# EAGLE schematic Sherline Configuration (EAGLE 6.4)

## Sheet 1 of 16
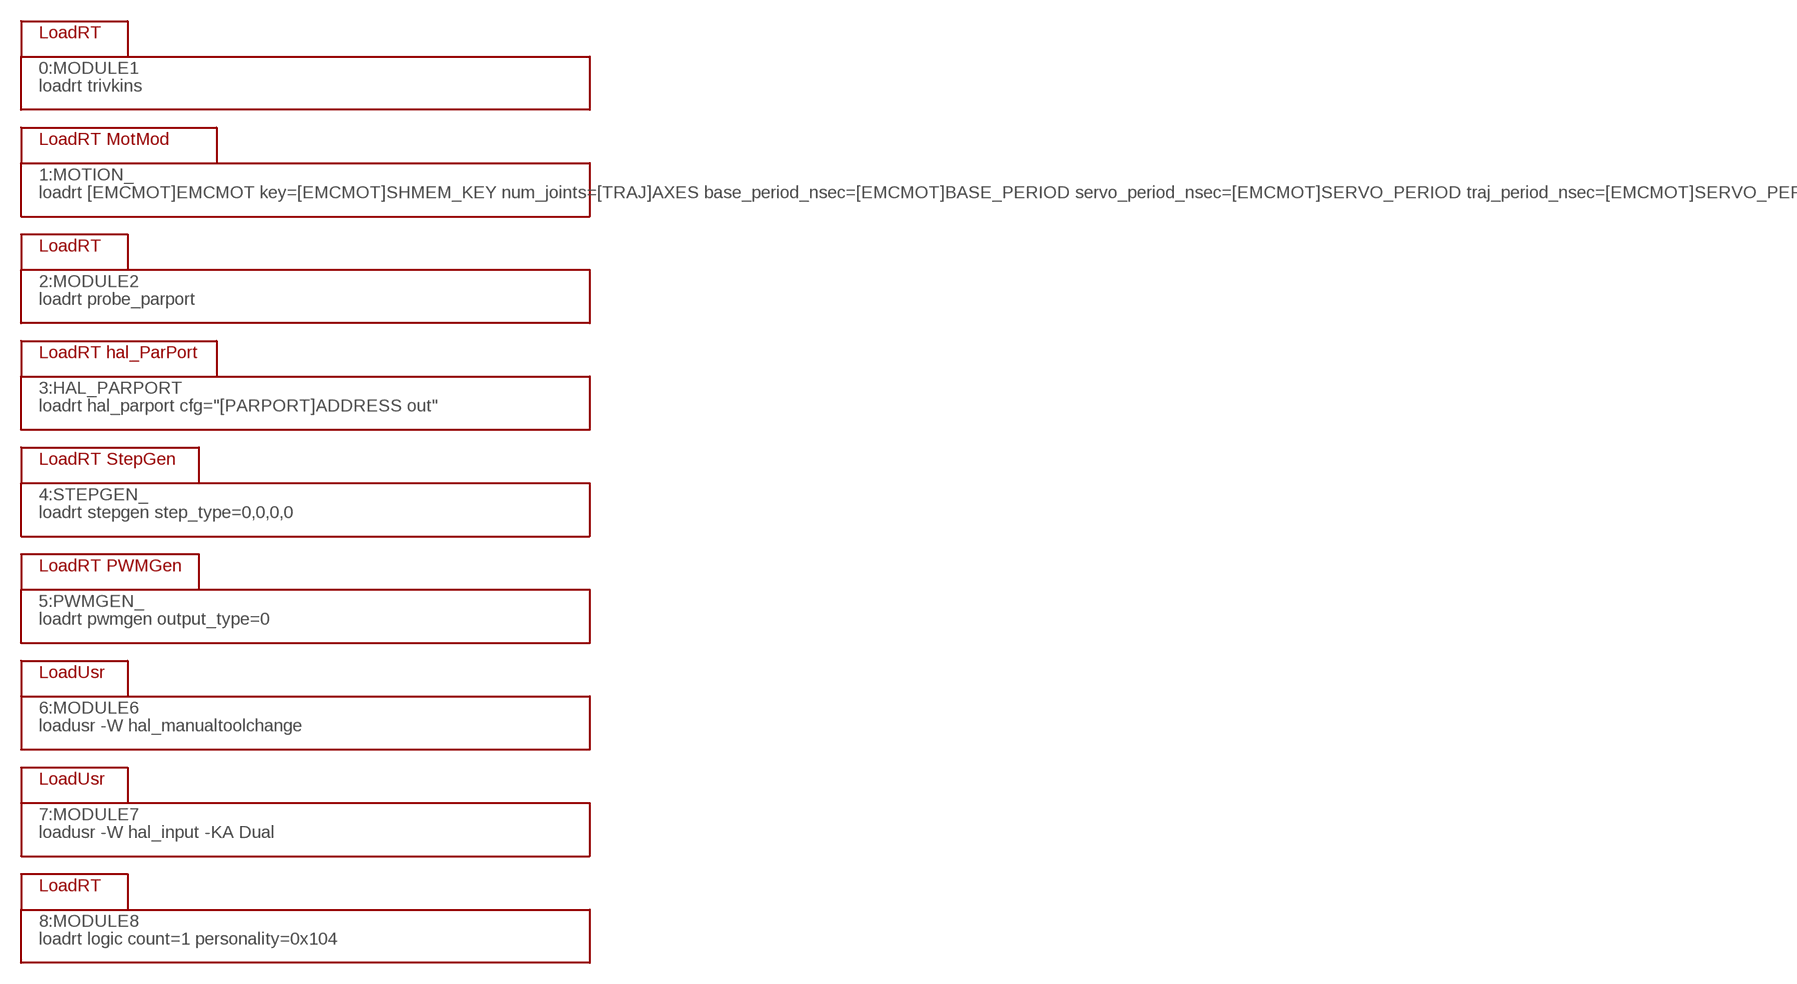
[diagram p0: schematic, sheet 1]

### Parts
0:MODULE1  loadrt trivkins  LOADRT  [DUMMY]
1:MOTION  loadrt [EMCMOT]EMCMOT key=[EMCMOT]SHMEM_KEY num_joints=[TRAJ]AXES base_period_nsec=[EMCMOT]BASE_PERIOD servo_period_nsec=[EMCMOT]SERVO_PERIOD traj_period_nsec=[EMCMOT]SERVO_PERIOD  LOADRT_MOTMOD  [DUMMY]
2:MODULE2  loadrt probe_parport  LOADRT  [DUMMY]
3:HAL_PARPORT  loadrt hal_parport cfg="[PARPORT]ADDRESS out"  LOADRT_PARPORT  [DUMMY]
4:STEPGEN  loadrt stepgen step_type=0,0,0,0  LOADRT_STEPGEN  [DUMMY]
5:PWMGEN  loadrt pwmgen output_type=0  LOADRT_PWMGEN  [DUMMY]
8:MODULE8  loadrt logic count=1 personality=0x104  LOADRT  [DUMMY]
Unconnected: 3:HAL_PARPORT.P$1(PIN_THREAD) 3:HAL_PARPORT.P$2(PIN_THREAD)

## Sheet 2 of 16
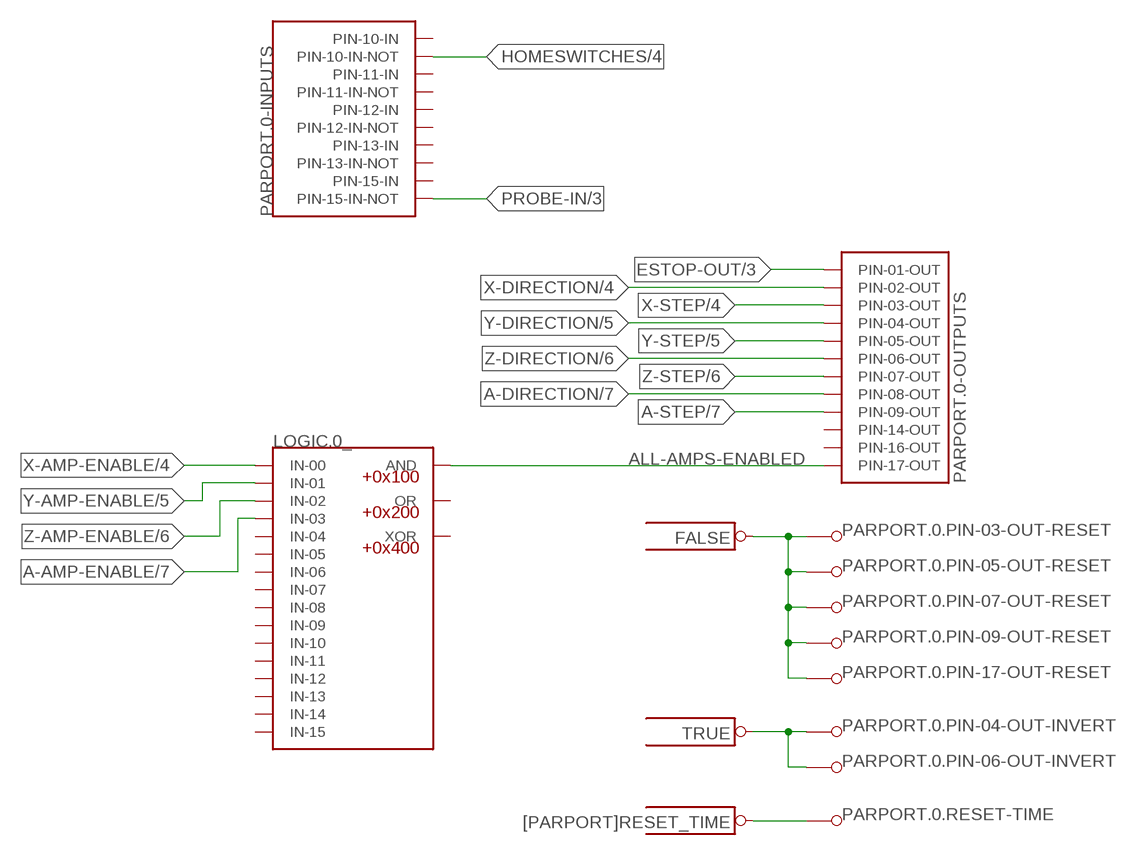
[diagram p1: schematic, sheet 2]

### Parts
LOGIC.0  LOGIC  [DUMMY]
PARAMETER0  [PARPORT]RESET_TIME  PARAMETER  [DUMMY]
PARAMETER8  FALSE  PARAMETER  [DUMMY]
PARAMETER30  TRUE  PARAMETER  [DUMMY]
PARPORT.0  PARPORT-OUT  [DUMMY]

### Nets
A-AMP-ENABLE: LOGIC.0.P$6(_:IN-03) ; also sheet 7
A-DIRECTION: PARPORT.0.P$41(-OUTPUTS:PIN-08-OUT) ; also sheet 7
A-STEP: PARPORT.0.P$42(-OUTPUTS:PIN-09-OUT) ; also sheet 7
ALL-AMPS-ENABLED: LOGIC.0.P$2(_:AND) PARPORT.0.P$45(-OUTPUTS:PIN-17-OUT)
ESTOP-OUT: PARPORT.0.P$34(-OUTPUTS:PIN-01-OUT) ; also sheet 3
HOMESWITCHES: PARPORT.0.P$25(-INPUTS:PIN-10-IN-NOT) ; also sheet 4,5,6,7
N$1: PARAMETER0.P$1 PARPORT.0.P$22(.RESET-TIME:PIN_PARAMETER)
N$12: PARAMETER8.P$1 PARPORT.0.P$5(.PIN-03-OUT-RESET:PIN_PARAMETER) PARPORT.0.P$9(.PIN-05-OUT-RESET:PIN_PARAMETER) PARPORT.0.P$13(.PIN-07-OUT-RESET:PIN_PARAMETER) PARPORT.0.P$17(.PIN-09-OUT-RESET:PIN_PARAMETER) PARPORT.0.P$50(.PIN-17-OUT-RESET:PIN_PARAMETER)
N$81: PARAMETER30.P$1 PARPORT.0.P$6(.PIN-04-OUT-INVERT:PIN_PARAMETER) PARPORT.0.P$10(.PIN-06-OUT-INVERT:PIN_PARAMETER)
PROBE-IN: PARPORT.0.P$33(-INPUTS:PIN-15-IN-NOT) ; also sheet 3
X-AMP-ENABLE: LOGIC.0.P$3(_:IN-00) ; also sheet 4
X-DIRECTION: PARPORT.0.P$35(-OUTPUTS:PIN-02-OUT) ; also sheet 4
X-STEP: PARPORT.0.P$36(-OUTPUTS:PIN-03-OUT) ; also sheet 4
Y-AMP-ENABLE: LOGIC.0.P$4(_:IN-01) ; also sheet 5
Y-DIRECTION: PARPORT.0.P$37(-OUTPUTS:PIN-04-OUT) ; also sheet 5
Y-STEP: PARPORT.0.P$38(-OUTPUTS:PIN-05-OUT) ; also sheet 5
Z-AMP-ENABLE: LOGIC.0.P$5(_:IN-02) ; also sheet 6
Z-DIRECTION: PARPORT.0.P$39(-OUTPUTS:PIN-06-OUT) ; also sheet 6
Z-STEP: PARPORT.0.P$40(-OUTPUTS:PIN-07-OUT) ; also sheet 6
Unconnected: LOGIC.0.P$7(_:IN-04) LOGIC.0.P$8(_:IN-05) LOGIC.0.P$9(_:IN-06) LOGIC.0.P$10(_:IN-07) LOGIC.0.P$11(_:IN-08) LOGIC.0.P$12(_:IN-09) LOGIC.0.P$13(_:IN-10) LOGIC.0.P$14(_:IN-11) LOGIC.0.P$15(_:IN-12) LOGIC.0.P$16(_:IN-13) LOGIC.0.P$17(_:IN-14) LOGIC.0.P$18(_:IN-15) LOGIC.0.P$19(_:OR) LOGIC.0.P$20(_:XOR) PARPORT.0.P$1(.PIN-01-OUT-INVERT:PIN_PARAMETER) PARPORT.0.P$2(.PIN-02-OUT-INVERT:PIN_PARAMETER) PARPORT.0.P$3(.PIN-02-OUT-RESET:PIN_PARAMETER) PARPORT.0.P$4(.PIN-03-OUT-INVERT:PIN_PARAMETER) PARPORT.0.P$7(.PIN-04-OUT-RESET:PIN_PARAMETER) PARPORT.0.P$8(.PIN-05-OUT-INVERT:PIN_PARAMETER) PARPORT.0.P$11(.PIN-06-OUT-RESET:PIN_PARAMETER) PARPORT.0.P$12(.PIN-07-OUT-INVERT:PIN_PARAMETER) PARPORT.0.P$14(.PIN-08-OUT-INVERT:PIN_PARAMETER) PARPORT.0.P$15(.PIN-08-OUT-RESET:PIN_PARAMETER) PARPORT.0.P$16(.PIN-09-OUT-INVERT:PIN_PARAMETER) PARPORT.0.P$18(.PIN-14-OUT-INVERT:PIN_PARAMETER) PARPORT.0.P$19(.PIN-16-OUT-INVERT:PIN_PARAMETER) PARPORT.0.P$20(.PIN-17-OUT-INVERT:PIN_PARAMETER) PARPORT.0.P$24(-INPUTS:PIN-10-IN) PARPORT.0.P$26(-INPUTS:PIN-11-IN) PARPORT.0.P$27(-INPUTS:PIN-11-IN-NOT) PARPORT.0.P$28(-INPUTS:PIN-12-IN) PARPORT.0.P$29(-INPUTS:PIN-12-IN-NOT) PARPORT.0.P$30(-INPUTS:PIN-13-IN) PARPORT.0.P$31(-INPUTS:PIN-13-IN-NOT) PARPORT.0.P$32(-INPUTS:PIN-15-IN) PARPORT.0.P$43(-OUTPUTS:PIN-14-OUT) PARPORT.0.P$44(-OUTPUTS:PIN-16-OUT) PARPORT.0.P$47(.PIN-01-OUT-RESET:PIN_PARAMETER) PARPORT.0.P$48(.PIN-14-OUT-RESET:PIN_PARAMETER) PARPORT.0.P$49(.PIN-16-OUT-RESET:PIN_PARAMETER)

## Sheet 3 of 16
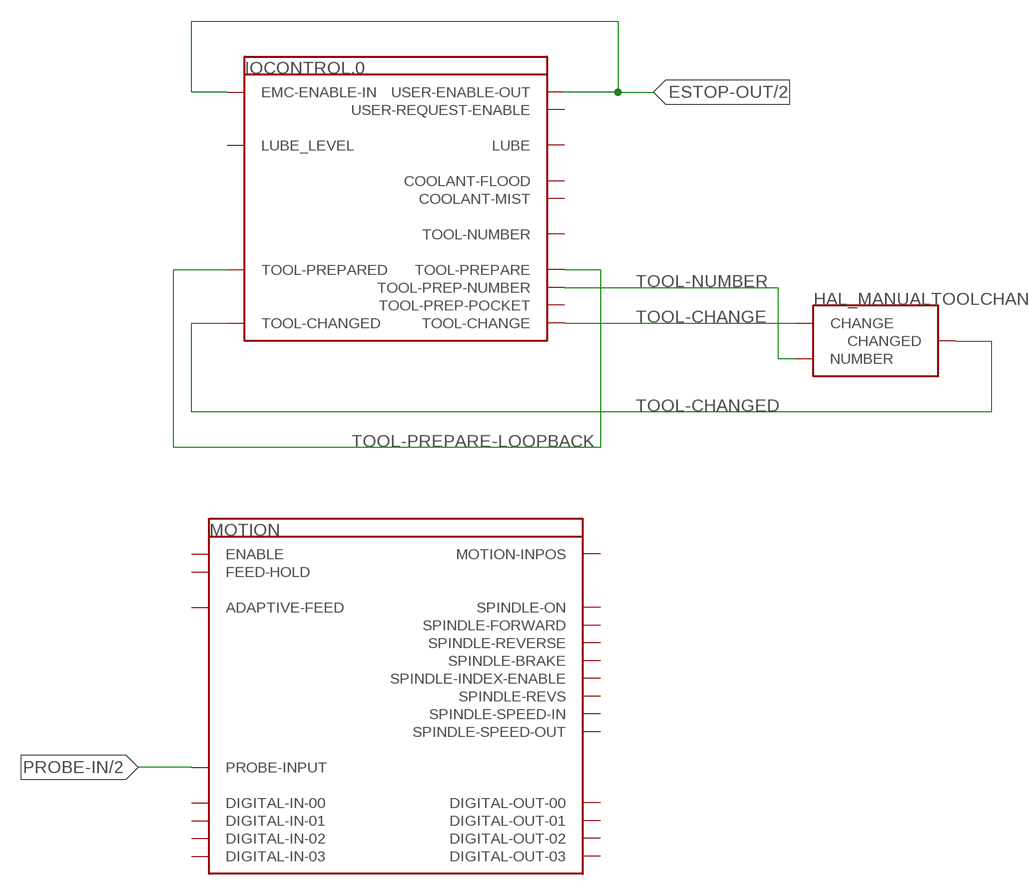
[diagram p2: schematic, sheet 3]

### Parts
HAL_MANUALTOOLCHANGE  HAL_MANUALTOOLCHANGE  [DUMMY]
IOCONTROL.0  IOCONTROL  [DUMMY]
MOTION  MOTION  [DUMMY]

### Nets
ESTOP-OUT: IOCONTROL.0.P$3(EMC-ENABLE-IN) IOCONTROL.0.P$11(USER-ENABLE-OUT) ; also sheet 2
PROBE-IN: MOTION.P$23(PROBE-INPUT) ; also sheet 2
TOOL-CHANGE: HAL_MANUALTOOLCHANGE.P$1(CHANGE) IOCONTROL.0.P$6(TOOL-CHANGE)
TOOL-CHANGED: HAL_MANUALTOOLCHANGE.P$2(CHANGED) IOCONTROL.0.P$7(TOOL-CHANGED)
TOOL-NUMBER: HAL_MANUALTOOLCHANGE.P$3(NUMBER) IOCONTROL.0.P$8(TOOL-PREP-NUMBER)
TOOL-PREPARE-LOOPBACK: IOCONTROL.0.P$9(TOOL-PREPARE) IOCONTROL.0.P$10(TOOL-PREPARED)
Unconnected: IOCONTROL.0.P$1(COOLANT-FLOOD) IOCONTROL.0.P$2(COOLANT-MIST) IOCONTROL.0.P$4(LUBE) IOCONTROL.0.P$5(LUBE_LEVEL) IOCONTROL.0.P$12(USER-REQUEST-ENABLE) IOCONTROL.0.P$13(TOOL-NUMBER) IOCONTROL.0.P$14(TOOL-PREP-POCKET) MOTION.P$1(PIN_PARAMETER) MOTION.P$2(PIN_PARAMETER) MOTION.P$3(PIN_PARAMETER) MOTION.P$4(PIN_PARAMETER) MOTION.P$5(PIN_PARAMETER) MOTION.P$6(PIN_PARAMETER) MOTION.P$7(PIN_PARAMETER) MOTION.P$8(PIN_PARAMETER) MOTION.P$9(PIN_PARAMETER) MOTION.P$10(PIN_PARAMETER) MOTION.P$11(ADAPTIVE-FEED) MOTION.P$12(DIGITAL-IN-00) MOTION.P$13(DIGITAL-IN-01) MOTION.P$14(DIGITAL-IN-02) MOTION.P$15(DIGITAL-IN-03) MOTION.P$16(DIGITAL-OUT-00) MOTION.P$17(DIGITAL-OUT-01) MOTION.P$18(DIGITAL-OUT-02) MOTION.P$19(DIGITAL-OUT-03) MOTION.P$20(ENABLE) MOTION.P$21(FEED-HOLD) MOTION.P$22(MOTION-INPOS) MOTION.P$24(SPINDLE-BRAKE) MOTION.P$25(SPINDLE-FORWARD) MOTION.P$26(SPINDLE-INDEX-ENABLE) MOTION.P$27(SPINDLE-ON) MOTION.P$28(SPINDLE-REVERSE) MOTION.P$29(SPINDLE-REVS) MOTION.P$30(SPINDLE-SPEED-IN) MOTION.P$31(SPINDLE-SPEED-OUT)

## Sheet 4 of 16
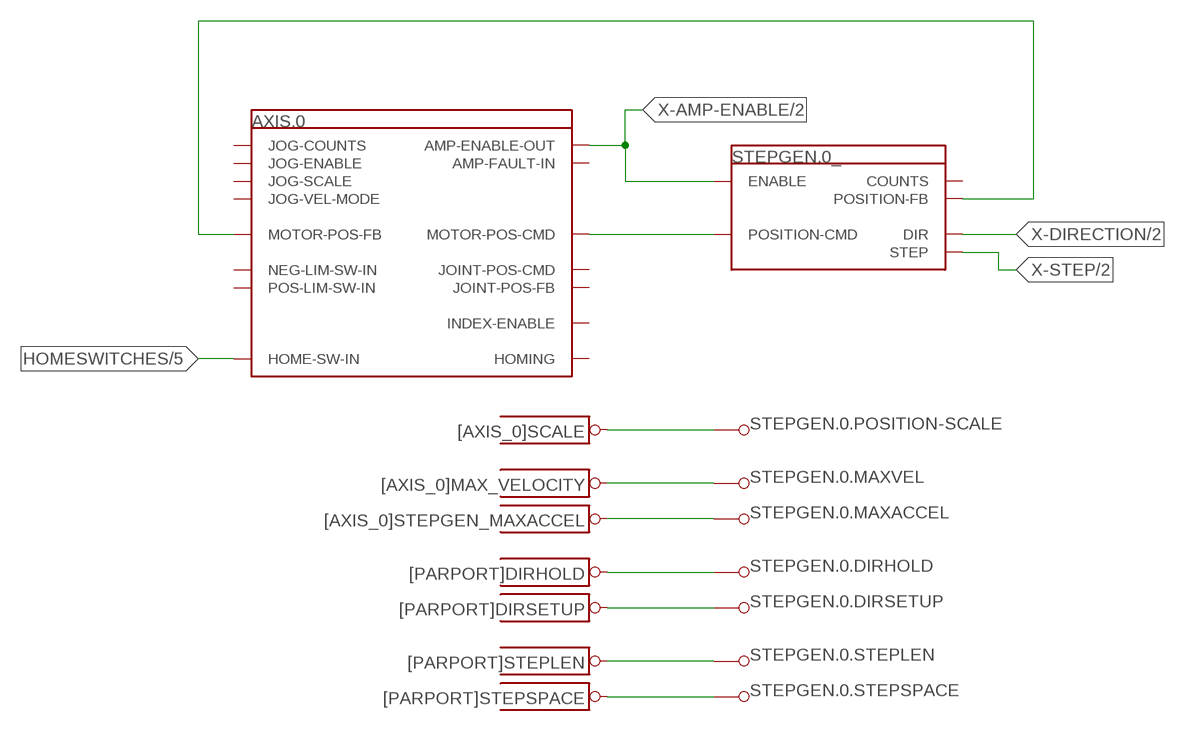
[diagram p3: schematic, sheet 4]

### Parts
AXIS.0  AXIS  [DUMMY]
PARAMETER1  [AXIS_0]MAX_VELOCITY  PARAMETER  [DUMMY]
PARAMETER2  [AXIS_0]STEPGEN_MAXACCEL  PARAMETER  [DUMMY]
PARAMETER3  [PARPORT]DIRHOLD  PARAMETER  [DUMMY]
PARAMETER4  [PARPORT]DIRSETUP  PARAMETER  [DUMMY]
PARAMETER5  [PARPORT]STEPLEN  PARAMETER  [DUMMY]
PARAMETER6  [PARPORT]STEPSPACE  PARAMETER  [DUMMY]
PARAMETER7  [AXIS_0]SCALE  PARAMETER  [DUMMY]
STEPGEN.0  STEPGEN-0  [DUMMY]

### Nets
HOMESWITCHES: AXIS.0.P$24(HOME-SW-IN) ; also sheet 2,5,6,7
N$2: PARAMETER2.P$1 STEPGEN.0.P$5(.MAXACCEL:PIN_PARAMETER)
N$3: PARAMETER1.P$1 STEPGEN.0.P$6(.MAXVEL:PIN_PARAMETER)
N$4: PARAMETER3.P$1 STEPGEN.0.P$2(.DIRHOLD:PIN_PARAMETER)
N$5: PARAMETER4.P$1 STEPGEN.0.P$3(.DIRSETUP:PIN_PARAMETER)
N$6: PARAMETER5.P$1 STEPGEN.0.P$9(.STEPLEN:PIN_PARAMETER)
N$7: PARAMETER6.P$1 STEPGEN.0.P$10(.STEPSPACE:PIN_PARAMETER)
N$8: PARAMETER7.P$1 STEPGEN.0.P$7(.POSITION-SCALE:PIN_PARAMETER)
N$9: AXIS.0.P$33(MOTOR-POS-CMD) STEPGEN.0.P$16(_:POSITION-CMD)
N$11: AXIS.0.P$34(MOTOR-POS-FB) STEPGEN.0.P$17(_:POSITION-FB)
X-AMP-ENABLE: AXIS.0.P$22(AMP-ENABLE-OUT) STEPGEN.0.P$15(_:ENABLE) ; also sheet 2
X-DIRECTION: STEPGEN.0.P$14(_:DIR) ; also sheet 2
X-STEP: STEPGEN.0.P$18(_:STEP) ; also sheet 2
Unconnected: AXIS.0.P$1(PIN_PARAMETER) AXIS.0.P$2(PIN_PARAMETER) AXIS.0.P$3(PIN_PARAMETER) AXIS.0.P$4(PIN_PARAMETER) AXIS.0.P$5(PIN_PARAMETER) AXIS.0.P$6(PIN_PARAMETER) AXIS.0.P$7(PIN_PARAMETER) AXIS.0.P$8(PIN_PARAMETER) AXIS.0.P$9(PIN_PARAMETER) AXIS.0.P$10(PIN_PARAMETER) AXIS.0.P$11(PIN_PARAMETER) AXIS.0.P$12(PIN_PARAMETER) AXIS.0.P$13(PIN_PARAMETER) AXIS.0.P$14(PIN_PARAMETER) AXIS.0.P$15(PIN_PARAMETER) AXIS.0.P$16(PIN_PARAMETER) AXIS.0.P$17(PIN_PARAMETER) AXIS.0.P$18(PIN_PARAMETER) AXIS.0.P$19(PIN_PARAMETER) AXIS.0.P$20(PIN_PARAMETER) AXIS.0.P$21(PIN_PARAMETER) AXIS.0.P$23(AMP-FAULT-IN) AXIS.0.P$25(HOMING) AXIS.0.P$26(INDEX-ENABLE) AXIS.0.P$27(JOG-COUNTS) AXIS.0.P$28(JOG-ENABLE) AXIS.0.P$29(JOG-SCALE) AXIS.0.P$30(JOG-VEL-MODE) AXIS.0.P$31(JOINT-POS-CMD) AXIS.0.P$32(JOINT-POS-FB) AXIS.0.P$35(NEG-LIM-SW-IN) AXIS.0.P$36(POS-LIM-SW-IN) STEPGEN.0.P$4(.FREQUENCY:PIN_PARAMETER) STEPGEN.0.P$8(.RAWCOUNTS:PIN_PARAMETER) STEPGEN.0.P$13(_:COUNTS)

## Sheet 5 of 16
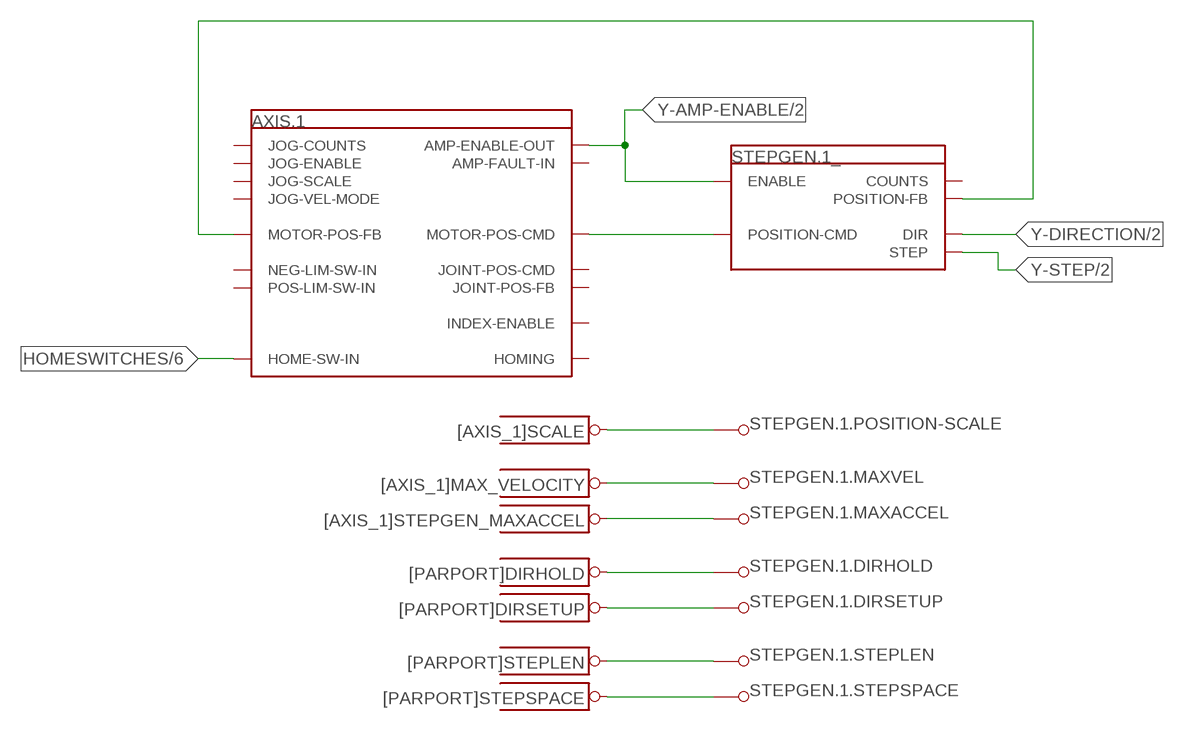
[diagram p4: schematic, sheet 5]

### Parts
AXIS.1  AXIS  [DUMMY]
PARAMETER9  [AXIS_1]MAX_VELOCITY  PARAMETER  [DUMMY]
PARAMETER10  [AXIS_1]STEPGEN_MAXACCEL  PARAMETER  [DUMMY]
PARAMETER11  [PARPORT]DIRHOLD  PARAMETER  [DUMMY]
PARAMETER12  [PARPORT]DIRSETUP  PARAMETER  [DUMMY]
PARAMETER13  [PARPORT]STEPLEN  PARAMETER  [DUMMY]
PARAMETER14  [PARPORT]STEPSPACE  PARAMETER  [DUMMY]
PARAMETER15  [AXIS_1]SCALE  PARAMETER  [DUMMY]
STEPGEN.1  STEPGEN-0  [DUMMY]

### Nets
HOMESWITCHES: AXIS.1.P$24(HOME-SW-IN) ; also sheet 2,4,6,7
N$27: PARAMETER10.P$1 STEPGEN.1.P$5(.MAXACCEL:PIN_PARAMETER)
N$28: PARAMETER9.P$1 STEPGEN.1.P$6(.MAXVEL:PIN_PARAMETER)
N$29: PARAMETER11.P$1 STEPGEN.1.P$2(.DIRHOLD:PIN_PARAMETER)
N$30: PARAMETER12.P$1 STEPGEN.1.P$3(.DIRSETUP:PIN_PARAMETER)
N$31: PARAMETER13.P$1 STEPGEN.1.P$9(.STEPLEN:PIN_PARAMETER)
N$32: PARAMETER14.P$1 STEPGEN.1.P$10(.STEPSPACE:PIN_PARAMETER)
N$33: PARAMETER15.P$1 STEPGEN.1.P$7(.POSITION-SCALE:PIN_PARAMETER)
N$34: AXIS.1.P$33(MOTOR-POS-CMD) STEPGEN.1.P$16(_:POSITION-CMD)
N$36: AXIS.1.P$34(MOTOR-POS-FB) STEPGEN.1.P$17(_:POSITION-FB)
Y-AMP-ENABLE: AXIS.1.P$22(AMP-ENABLE-OUT) STEPGEN.1.P$15(_:ENABLE) ; also sheet 2
Y-DIRECTION: STEPGEN.1.P$14(_:DIR) ; also sheet 2
Y-STEP: STEPGEN.1.P$18(_:STEP) ; also sheet 2
Unconnected: AXIS.1.P$1(PIN_PARAMETER) AXIS.1.P$2(PIN_PARAMETER) AXIS.1.P$3(PIN_PARAMETER) AXIS.1.P$4(PIN_PARAMETER) AXIS.1.P$5(PIN_PARAMETER) AXIS.1.P$6(PIN_PARAMETER) AXIS.1.P$7(PIN_PARAMETER) AXIS.1.P$8(PIN_PARAMETER) AXIS.1.P$9(PIN_PARAMETER) AXIS.1.P$10(PIN_PARAMETER) AXIS.1.P$11(PIN_PARAMETER) AXIS.1.P$12(PIN_PARAMETER) AXIS.1.P$13(PIN_PARAMETER) AXIS.1.P$14(PIN_PARAMETER) AXIS.1.P$15(PIN_PARAMETER) AXIS.1.P$16(PIN_PARAMETER) AXIS.1.P$17(PIN_PARAMETER) AXIS.1.P$18(PIN_PARAMETER) AXIS.1.P$19(PIN_PARAMETER) AXIS.1.P$20(PIN_PARAMETER) AXIS.1.P$21(PIN_PARAMETER) AXIS.1.P$23(AMP-FAULT-IN) AXIS.1.P$25(HOMING) AXIS.1.P$26(INDEX-ENABLE) AXIS.1.P$27(JOG-COUNTS) AXIS.1.P$28(JOG-ENABLE) AXIS.1.P$29(JOG-SCALE) AXIS.1.P$30(JOG-VEL-MODE) AXIS.1.P$31(JOINT-POS-CMD) AXIS.1.P$32(JOINT-POS-FB) AXIS.1.P$35(NEG-LIM-SW-IN) AXIS.1.P$36(POS-LIM-SW-IN) STEPGEN.1.P$4(.FREQUENCY:PIN_PARAMETER) STEPGEN.1.P$8(.RAWCOUNTS:PIN_PARAMETER) STEPGEN.1.P$13(_:COUNTS)

## Sheet 6 of 16
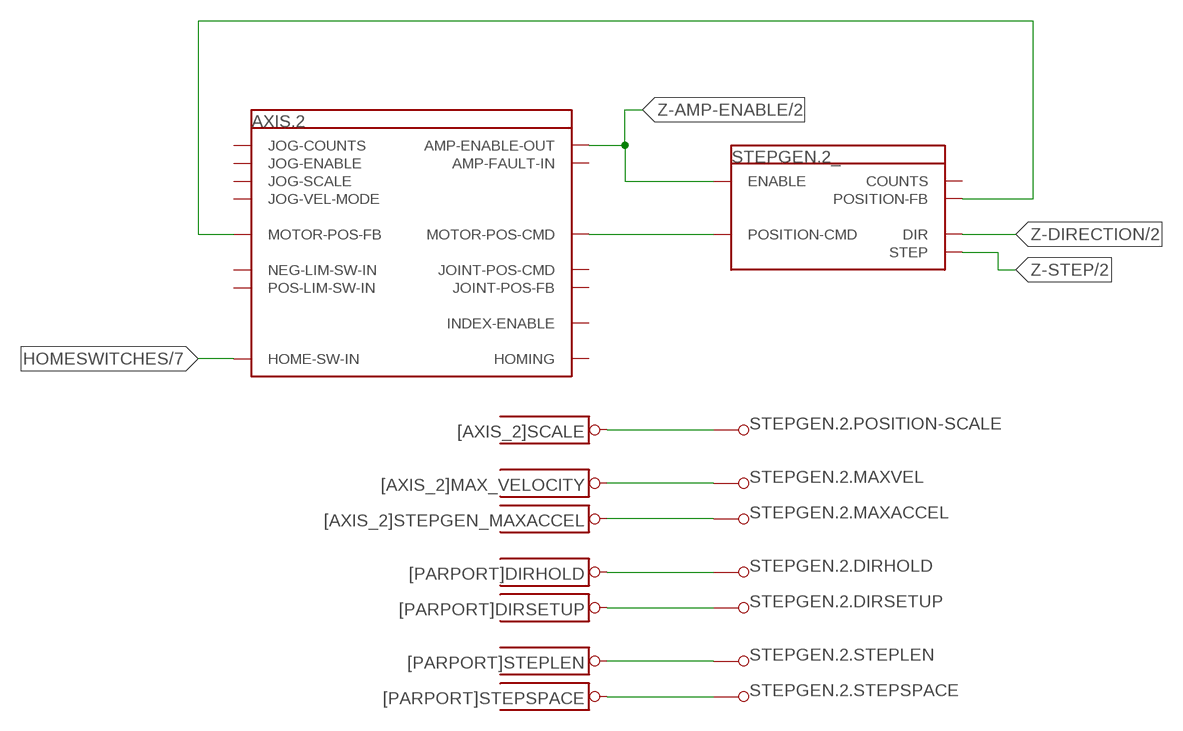
[diagram p5: schematic, sheet 6]

### Parts
AXIS.2  AXIS  [DUMMY]
PARAMETER16  [AXIS_2]MAX_VELOCITY  PARAMETER  [DUMMY]
PARAMETER17  [AXIS_2]STEPGEN_MAXACCEL  PARAMETER  [DUMMY]
PARAMETER18  [PARPORT]DIRHOLD  PARAMETER  [DUMMY]
PARAMETER19  [PARPORT]DIRSETUP  PARAMETER  [DUMMY]
PARAMETER20  [PARPORT]STEPLEN  PARAMETER  [DUMMY]
PARAMETER21  [PARPORT]STEPSPACE  PARAMETER  [DUMMY]
PARAMETER22  [AXIS_2]SCALE  PARAMETER  [DUMMY]
STEPGEN.2  STEPGEN-0  [DUMMY]

### Nets
HOMESWITCHES: AXIS.2.P$24(HOME-SW-IN) ; also sheet 2,4,5,7
N$37: PARAMETER17.P$1 STEPGEN.2.P$5(.MAXACCEL:PIN_PARAMETER)
N$38: PARAMETER16.P$1 STEPGEN.2.P$6(.MAXVEL:PIN_PARAMETER)
N$39: PARAMETER18.P$1 STEPGEN.2.P$2(.DIRHOLD:PIN_PARAMETER)
N$40: PARAMETER19.P$1 STEPGEN.2.P$3(.DIRSETUP:PIN_PARAMETER)
N$41: PARAMETER20.P$1 STEPGEN.2.P$9(.STEPLEN:PIN_PARAMETER)
N$65: PARAMETER21.P$1 STEPGEN.2.P$10(.STEPSPACE:PIN_PARAMETER)
N$66: PARAMETER22.P$1 STEPGEN.2.P$7(.POSITION-SCALE:PIN_PARAMETER)
N$67: AXIS.2.P$33(MOTOR-POS-CMD) STEPGEN.2.P$16(_:POSITION-CMD)
N$69: AXIS.2.P$34(MOTOR-POS-FB) STEPGEN.2.P$17(_:POSITION-FB)
Z-AMP-ENABLE: AXIS.2.P$22(AMP-ENABLE-OUT) STEPGEN.2.P$15(_:ENABLE) ; also sheet 2
Z-DIRECTION: STEPGEN.2.P$14(_:DIR) ; also sheet 2
Z-STEP: STEPGEN.2.P$18(_:STEP) ; also sheet 2
Unconnected: AXIS.2.P$1(PIN_PARAMETER) AXIS.2.P$2(PIN_PARAMETER) AXIS.2.P$3(PIN_PARAMETER) AXIS.2.P$4(PIN_PARAMETER) AXIS.2.P$5(PIN_PARAMETER) AXIS.2.P$6(PIN_PARAMETER) AXIS.2.P$7(PIN_PARAMETER) AXIS.2.P$8(PIN_PARAMETER) AXIS.2.P$9(PIN_PARAMETER) AXIS.2.P$10(PIN_PARAMETER) AXIS.2.P$11(PIN_PARAMETER) AXIS.2.P$12(PIN_PARAMETER) AXIS.2.P$13(PIN_PARAMETER) AXIS.2.P$14(PIN_PARAMETER) AXIS.2.P$15(PIN_PARAMETER) AXIS.2.P$16(PIN_PARAMETER) AXIS.2.P$17(PIN_PARAMETER) AXIS.2.P$18(PIN_PARAMETER) AXIS.2.P$19(PIN_PARAMETER) AXIS.2.P$20(PIN_PARAMETER) AXIS.2.P$21(PIN_PARAMETER) AXIS.2.P$23(AMP-FAULT-IN) AXIS.2.P$25(HOMING) AXIS.2.P$26(INDEX-ENABLE) AXIS.2.P$27(JOG-COUNTS) AXIS.2.P$28(JOG-ENABLE) AXIS.2.P$29(JOG-SCALE) AXIS.2.P$30(JOG-VEL-MODE) AXIS.2.P$31(JOINT-POS-CMD) AXIS.2.P$32(JOINT-POS-FB) AXIS.2.P$35(NEG-LIM-SW-IN) AXIS.2.P$36(POS-LIM-SW-IN) STEPGEN.2.P$4(.FREQUENCY:PIN_PARAMETER) STEPGEN.2.P$8(.RAWCOUNTS:PIN_PARAMETER) STEPGEN.2.P$13(_:COUNTS)

## Sheet 7 of 16
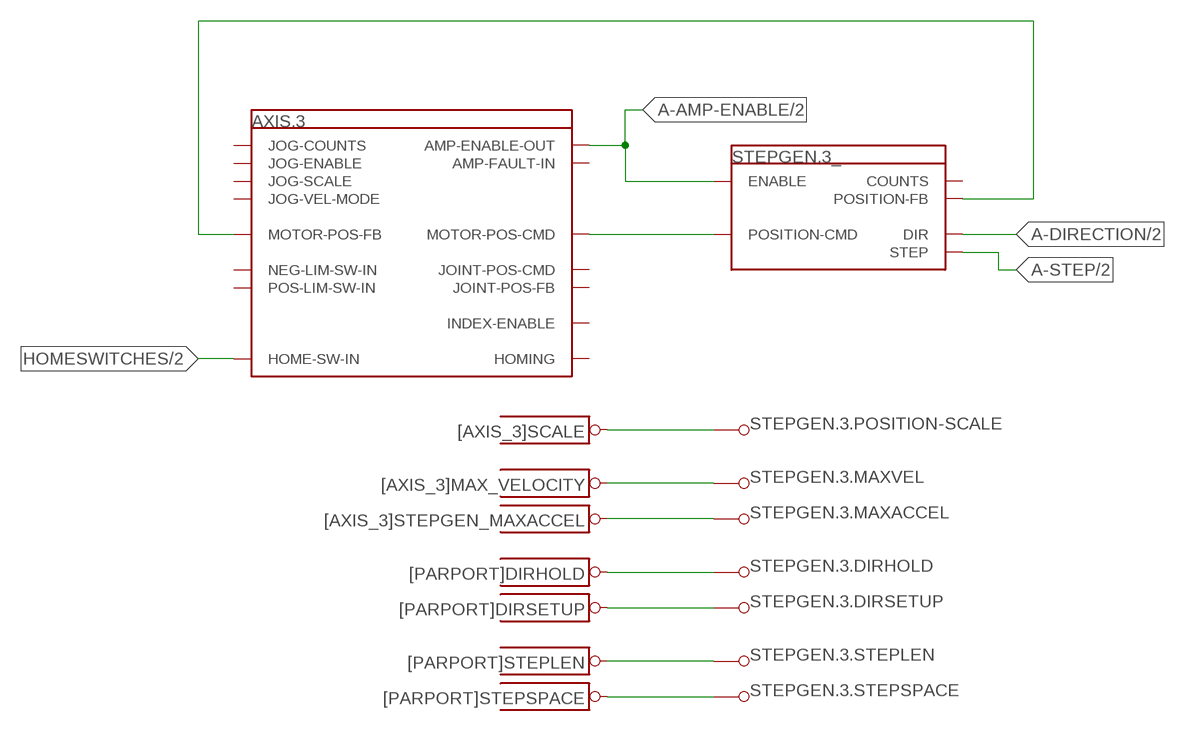
[diagram p6: schematic, sheet 7]

### Parts
AXIS.3  AXIS  [DUMMY]
PARAMETER23  [AXIS_3]MAX_VELOCITY  PARAMETER  [DUMMY]
PARAMETER24  [AXIS_3]STEPGEN_MAXACCEL  PARAMETER  [DUMMY]
PARAMETER25  [PARPORT]DIRHOLD  PARAMETER  [DUMMY]
PARAMETER26  [PARPORT]DIRSETUP  PARAMETER  [DUMMY]
PARAMETER27  [PARPORT]STEPLEN  PARAMETER  [DUMMY]
PARAMETER28  [PARPORT]STEPSPACE  PARAMETER  [DUMMY]
PARAMETER29  [AXIS_3]SCALE  PARAMETER  [DUMMY]
STEPGEN.3  STEPGEN-0  [DUMMY]

### Nets
A-AMP-ENABLE: AXIS.3.P$22(AMP-ENABLE-OUT) STEPGEN.3.P$15(_:ENABLE) ; also sheet 2
A-DIRECTION: STEPGEN.3.P$14(_:DIR) ; also sheet 2
A-STEP: STEPGEN.3.P$18(_:STEP) ; also sheet 2
HOMESWITCHES: AXIS.3.P$24(HOME-SW-IN) ; also sheet 2,4,5,6
N$70: PARAMETER24.P$1 STEPGEN.3.P$5(.MAXACCEL:PIN_PARAMETER)
N$71: PARAMETER23.P$1 STEPGEN.3.P$6(.MAXVEL:PIN_PARAMETER)
N$72: PARAMETER25.P$1 STEPGEN.3.P$2(.DIRHOLD:PIN_PARAMETER)
N$73: PARAMETER26.P$1 STEPGEN.3.P$3(.DIRSETUP:PIN_PARAMETER)
N$74: PARAMETER27.P$1 STEPGEN.3.P$9(.STEPLEN:PIN_PARAMETER)
N$75: PARAMETER28.P$1 STEPGEN.3.P$10(.STEPSPACE:PIN_PARAMETER)
N$76: PARAMETER29.P$1 STEPGEN.3.P$7(.POSITION-SCALE:PIN_PARAMETER)
N$77: AXIS.3.P$33(MOTOR-POS-CMD) STEPGEN.3.P$16(_:POSITION-CMD)
N$79: AXIS.3.P$34(MOTOR-POS-FB) STEPGEN.3.P$17(_:POSITION-FB)
Unconnected: AXIS.3.P$1(PIN_PARAMETER) AXIS.3.P$2(PIN_PARAMETER) AXIS.3.P$3(PIN_PARAMETER) AXIS.3.P$4(PIN_PARAMETER) AXIS.3.P$5(PIN_PARAMETER) AXIS.3.P$6(PIN_PARAMETER) AXIS.3.P$7(PIN_PARAMETER) AXIS.3.P$8(PIN_PARAMETER) AXIS.3.P$9(PIN_PARAMETER) AXIS.3.P$10(PIN_PARAMETER) AXIS.3.P$11(PIN_PARAMETER) AXIS.3.P$12(PIN_PARAMETER) AXIS.3.P$13(PIN_PARAMETER) AXIS.3.P$14(PIN_PARAMETER) AXIS.3.P$15(PIN_PARAMETER) AXIS.3.P$16(PIN_PARAMETER) AXIS.3.P$17(PIN_PARAMETER) AXIS.3.P$18(PIN_PARAMETER) AXIS.3.P$19(PIN_PARAMETER) AXIS.3.P$20(PIN_PARAMETER) AXIS.3.P$21(PIN_PARAMETER) AXIS.3.P$23(AMP-FAULT-IN) AXIS.3.P$25(HOMING) AXIS.3.P$26(INDEX-ENABLE) AXIS.3.P$27(JOG-COUNTS) AXIS.3.P$28(JOG-ENABLE) AXIS.3.P$29(JOG-SCALE) AXIS.3.P$30(JOG-VEL-MODE) AXIS.3.P$31(JOINT-POS-CMD) AXIS.3.P$32(JOINT-POS-FB) AXIS.3.P$35(NEG-LIM-SW-IN) AXIS.3.P$36(POS-LIM-SW-IN) STEPGEN.3.P$4(.FREQUENCY:PIN_PARAMETER) STEPGEN.3.P$8(.RAWCOUNTS:PIN_PARAMETER) STEPGEN.3.P$13(_:COUNTS)

## Sheet 8 of 16
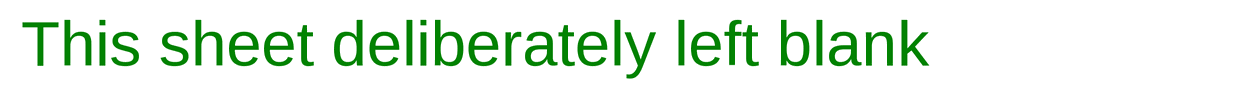
[diagram p7: schematic, sheet 8]

### Notes on the sheet
- This sheet deliberately left blank

## Sheet 9 of 16
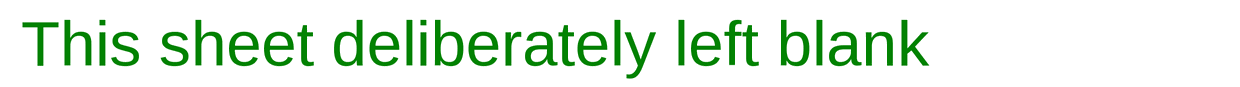
[diagram p8: schematic, sheet 9]

### Notes on the sheet
- This sheet deliberately left blank

## Sheet 10 of 16
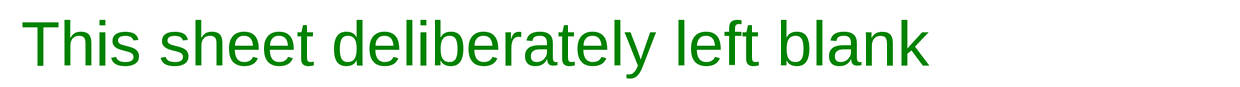
[diagram p9: schematic, sheet 10]

### Notes on the sheet
- This sheet deliberately left blank

## Sheet 11 of 16
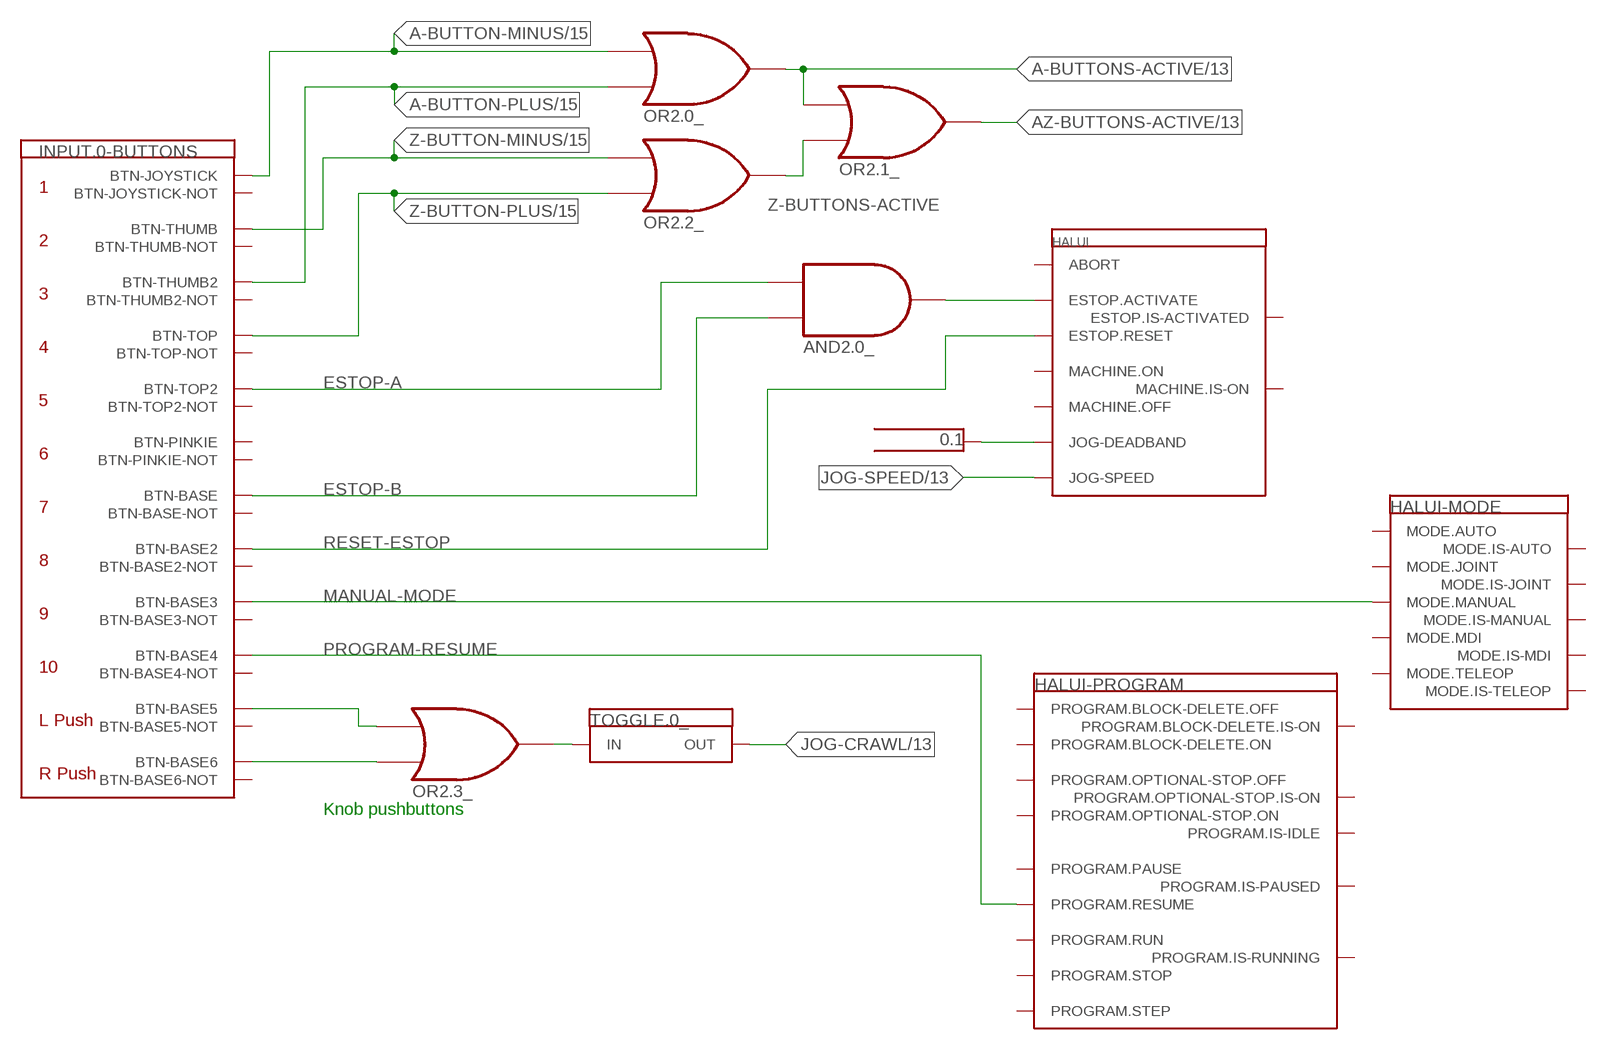
[diagram p10: schematic, sheet 11]

### Parts
AND2.0  AND2  [DUMMY]
CONSTANT.0  0.1  CONSTANT  [DUMMY]
HALUI  HALUI  [DUMMY]
INPUT.0  LOGITECH-DUAL-ACTION-GAMEPAD  [DUMMY]
OR2.0  OR2  [DUMMY]
OR2.1  OR2  [DUMMY]
OR2.2  OR2  [DUMMY]
OR2.3  OR2  [DUMMY]
TOGGLE.0  TOGGLE  [DUMMY]

### Nets
A-BUTTON-MINUS: INPUT.0.P$61(-BUTTONS:BTN-JOYSTICK) OR2.0.P$2(_:IN0) ; also sheet 15
A-BUTTON-PLUS: INPUT.0.P$67(-BUTTONS:BTN-THUMB2) OR2.0.P$3(_:IN1) ; also sheet 15
A-BUTTONS-ACTIVE: OR2.0.P$4(_:OUT) OR2.1.P$2(_:IN0) ; also sheet 13
AZ-BUTTONS-ACTIVE: OR2.1.P$4(_:OUT) ; also sheet 13,15
ESTOP-A: AND2.0.P$1(_:IN0) INPUT.0.P$71(-BUTTONS:BTN-TOP2)
ESTOP-B: AND2.0.P$2(_:IN1) INPUT.0.P$49(-BUTTONS:BTN-BASE)
JOG-CRAWL: TOGGLE.0.P$3(_:OUT) ; also sheet 13
JOG-SPEED: HALUI.P$82(JOG-SPEED) ; also sheet 13
MANUAL-MODE: HALUI.P$72(MODE.MANUAL) INPUT.0.P$53(-BUTTONS:BTN-BASE3)
N$13: AND2.0.P$3(_:OUT) HALUI.P$2(ESTOP.ACTIVATE)
N$14: INPUT.0.P$57(-BUTTONS:BTN-BASE5) OR2.3.P$2(_:IN0)
N$15: INPUT.0.P$59(-BUTTONS:BTN-BASE6) OR2.3.P$3(_:IN1)
N$16: OR2.3.P$4(_:OUT) TOGGLE.0.P$2(_:IN)
N$24: CONSTANT.0.P$2 HALUI.P$81(JOG-DEADBAND)
PROGRAM-RESUME: HALUI.P$43(PROGRAM.RESUME) INPUT.0.P$55(-BUTTONS:BTN-BASE4)
RESET-ESTOP: HALUI.P$4(ESTOP.RESET) INPUT.0.P$51(-BUTTONS:BTN-BASE2)
Z-BUTTON-MINUS: INPUT.0.P$65(-BUTTONS:BTN-THUMB) OR2.2.P$2(_:IN0) ; also sheet 15
Z-BUTTON-PLUS: INPUT.0.P$69(-BUTTONS:BTN-TOP) OR2.2.P$3(_:IN1) ; also sheet 15
Z-BUTTONS-ACTIVE: OR2.1.P$3(_:IN1) OR2.2.P$4(_:OUT)
Unconnected: HALUI.P$1(ABORT) HALUI.P$3(ESTOP.IS-ACTIVATED) HALUI.P$5(MACHINE.IS-ON) HALUI.P$6(MACHINE.OFF) HALUI.P$7(MACHINE.ON) HALUI.P$8(FLOOD.IS-ON) HALUI.P$9(FLOOD.OFF) HALUI.P$10(FLOOD.ON) HALUI.P$11(LUBE.IS-ON) HALUI.P$12(LUBE.OFF) HALUI.P$13(LUBE.ON) HALUI.P$14(MIST.IS-ON) HALUI.P$15(MIST.OFF) HALUI.P$16(MIST.ON) HALUI.P$17(FEED-OVERRIDE.COUNT-ENABLE) HALUI.P$18(FEED-OVERRIDE.COUNTS) HALUI.P$19(FEED-OVERRIDE.DECREASE) HALUI.P$20(FEED-OVERRIDE.INCREASE) HALUI.P$21(FEED-OVERRIDE.SCALE) HALUI.P$22(FEED-OVERRIDE.VALUE) HALUI.P$23(TOOL.LENGTH-OFFSET.A) HALUI.P$24(TOOL.LENGTH-OFFSET.B) HALUI.P$25(TOOL.LENGTH-OFFSET.C) HALUI.P$26(TOOL.LENGTH-OFFSET.U) HALUI.P$27(TOOL.LENGTH-OFFSET.V) HALUI.P$28(TOOL.LENGTH-OFFSET.W) HALUI.P$29(TOOL.LENGTH-OFFSET.X) HALUI.P$30(TOOL.LENGTH-OFFSET.Y) HALUI.P$31(TOOL.LENGTH-OFFSET.Z) HALUI.P$32(TOOL.NUMBER) HALUI.P$33(PROGRAM.BLOCK-DELETE.IS-ON) HALUI.P$34(PROGRAM.BLOCK-DELETE.OFF) HALUI.P$35(PROGRAM.BLOCK-DELETE.ON) HALUI.P$36(PROGRAM.IS-IDLE) HALUI.P$37(PROGRAM.IS-PAUSED) HALUI.P$38(PROGRAM.IS-RUNNING) HALUI.P$39(PROGRAM.OPTIONAL-STOP.IS-ON) HALUI.P$40(PROGRAM.OPTIONAL-STOP.OFF) HALUI.P$41(PROGRAM.OPTIONAL-STOP.ON) HALUI.P$42(PROGRAM.PAUSE) HALUI.P$44(PROGRAM.RUN) HALUI.P$45(PROGRAM.STEP) HALUI.P$46(PROGRAM.STOP) HALUI.P$47(SPINDLE-OVERRIDE.COUNT-ENABLE) HALUI.P$48(SPINDLE-OVERRIDE.COUNTS) HALUI.P$49(SPINDLE-OVERRIDE.DECREASE) HALUI.P$50(SPINDLE-OVERRIDE.INCREASE) HALUI.P$51(SPINDLE-OVERRIDE.SCALE) HALUI.P$52(SPINDLE-OVERRIDE.VALUE) HALUI.P$53(SPINDLE.BRAKE-IS-ON) HALUI.P$54(SPINDLE.BRAKE.OFF) HALUI.P$55(SPINDLE.BRAKE.ON) HALUI.P$56(SPINDLE.DECREASE) HALUI.P$57(SPINDLE.FORWARD) HALUI.P$58(SPINDLE.INCREASE) HALUI.P$59(SPINDLE.IS-ON) HALUI.P$60(SPINDLE.REVERSE) HALUI.P$61(SPINDLE.RUNS-BACKWARD) HALUI.P$62(SPINDLE.RUNS-FORWARD) HALUI.P$63(SPINDLE.START) HALUI.P$64(SPINDLE.STOP) HALUI.P$65(MODE.AUTO) HALUI.P$66(MODE.IS-AUTO) HALUI.P$67(MODE.IS-JOINT) HALUI.P$68(MODE.IS-MANUAL) HALUI.P$69(MODE.IS-MDI) HALUI.P$70(MODE.IS-TELEOP) HALUI.P$71(MODE.JOINT) HALUI.P$73(MODE.MDI) HALUI.P$74(MODE.TELEOP) HALUI.P$75(MAX-VELOCITY.COUNT-ENABLE) HALUI.P$76(MAX-VELOCITY.COUNTS) HALUI.P$77(MAX-VELOCITY.DECREASE) HALUI.P$78(MAX-VELOCITY.INCREASE) HALUI.P$79(MAX-VELOCITY.SCALE) HALUI.P$80(MAX-VELOCITY.VALUE) INPUT.0.P$50(-BUTTONS:BTN-BASE-NOT) INPUT.0.P$52(-BUTTONS:BTN-BASE2-NOT) INPUT.0.P$54(-BUTTONS:BTN-BASE3-NOT) INPUT.0.P$56(-BUTTONS:BTN-BASE4-NOT) INPUT.0.P$58(-BUTTONS:BTN-BASE5-NOT) INPUT.0.P$60(-BUTTONS:BTN-BASE6-NOT) INPUT.0.P$62(-BUTTONS:BTN-JOYSTICK-NOT) INPUT.0.P$63(-BUTTONS:BTN-PINKIE) INPUT.0.P$64(-BUTTONS:BTN-PINKIE-NOT) INPUT.0.P$66(-BUTTONS:BTN-THUMB-NOT) INPUT.0.P$68(-BUTTONS:BTN-THUMB2-NOT) INPUT.0.P$70(-BUTTONS:BTN-TOP-NOT) INPUT.0.P$72(-BUTTONS:BTN-TOP2-NOT) INPUT.0.P$73(.ABS-HAT0X-MAX:PIN_PARAMETER) INPUT.0.P$74(.ABS-HAT0X-MIN:PIN_PARAMETER) INPUT.0.P$75(.ABS-HAT0Y-MAX:PIN_PARAMETER) INPUT.0.P$76(.ABS-HAT0Y-MIN:PIN_PARAMETER) INPUT.0.P$77(.ABS-RZ-MAX:PIN_PARAMETER) INPUT.0.P$78(.ABS-RZ-MIN:PIN_PARAMETER) INPUT.0.P$79(.ABS-X-MAX:PIN_PARAMETER) INPUT.0.P$80(.ABS-X-MIN:PIN_PARAMETER) INPUT.0.P$81(.ABS-Y-MAX:PIN_PARAMETER) INPUT.0.P$82(.ABS-Y-MIN:PIN_PARAMETER) INPUT.0.P$83(.ABS-Z-MAX:PIN_PARAMETER) INPUT.0.P$84(.ABS-Z-MIN:PIN_PARAMETER) TOGGLE.0.P$4(.DEBOUNCE:PIN_PARAMETER)

### Notes on the sheet
- Knob pushbuttons

## Sheet 12 of 16
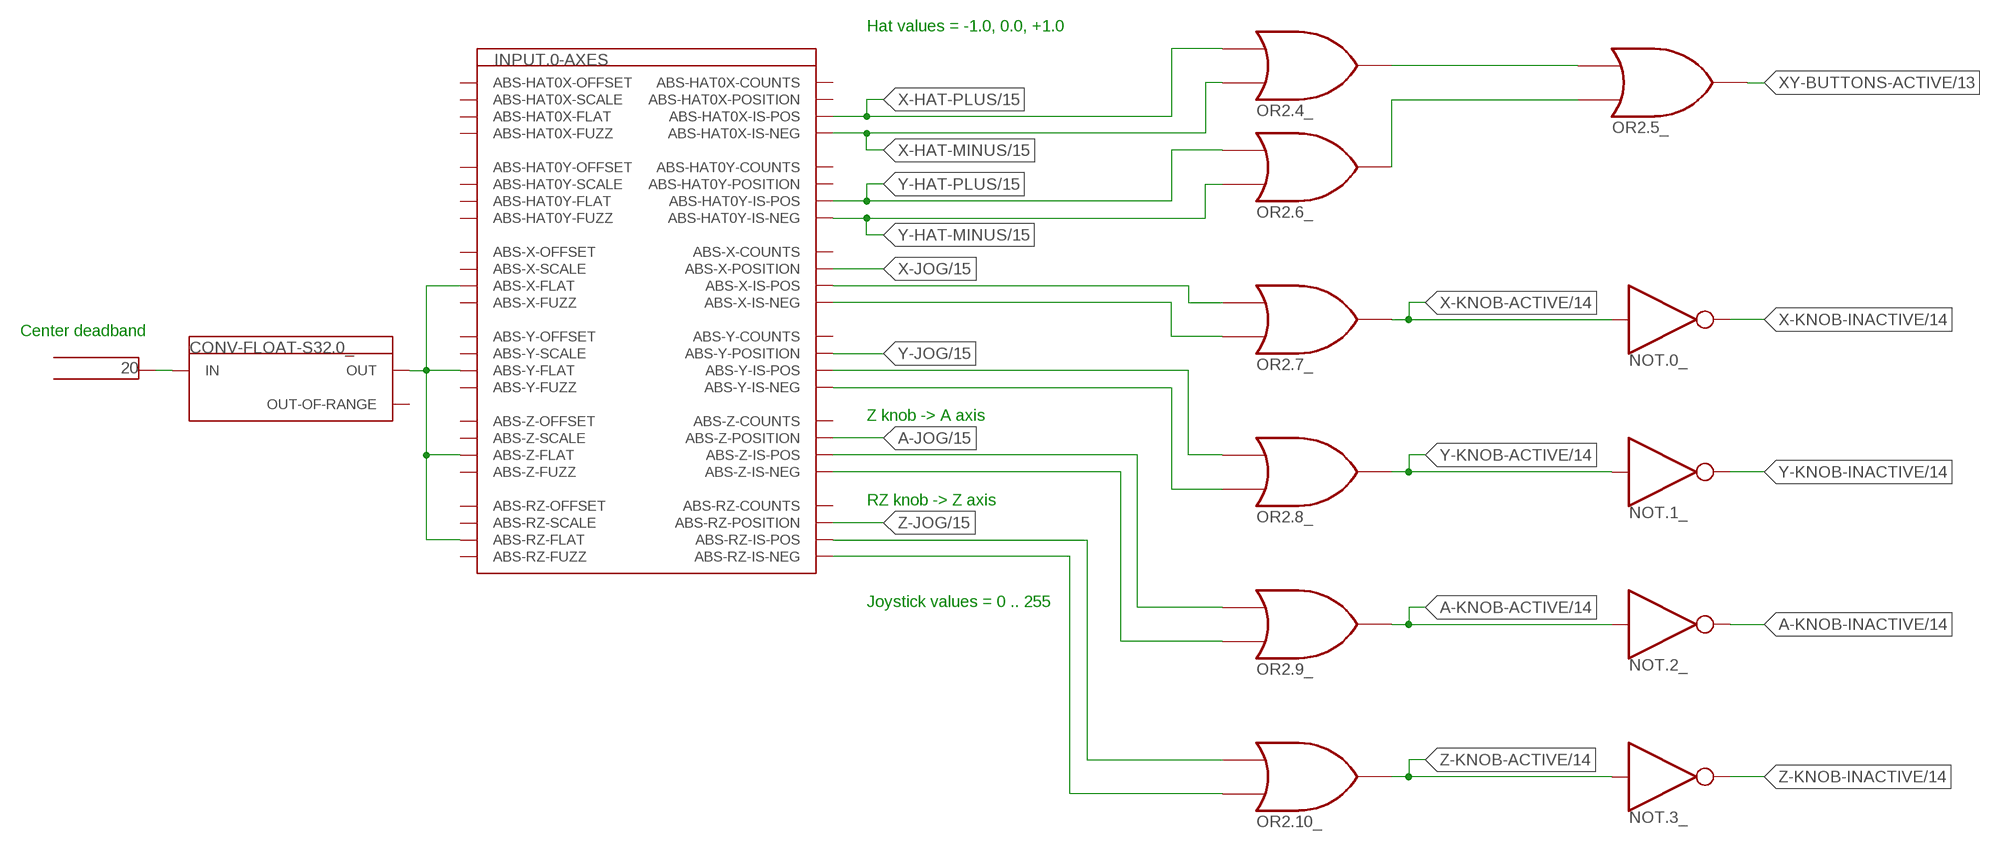
[diagram p11: schematic, sheet 12]

### Parts
CONSTANT.1  20  CONSTANT  [DUMMY]
CONV-FLOAT-S32.0  CONV_FLOAT_S32  [DUMMY]
NOT.0  NOT  [DUMMY]
NOT.1  NOT  [DUMMY]
NOT.2  NOT  [DUMMY]
NOT.3  NOT  [DUMMY]
OR2.4  OR2  [DUMMY]
OR2.5  OR2  [DUMMY]
OR2.6  OR2  [DUMMY]
OR2.7  OR2  [DUMMY]
OR2.8  OR2  [DUMMY]
OR2.9  OR2  [DUMMY]
OR2.10  OR2  [DUMMY]

### Nets
A-JOG: INPUT.0.P$47(-AXES:ABS-Z-POSITION) ; also sheet 15
A-KNOB-ACTIVE: NOT.2.P$1(_:IN) OR2.9.P$4(_:OUT) ; also sheet 14
A-KNOB-INACTIVE: NOT.2.P$2(_:OUT) ; also sheet 14
N$17: CONV-FLOAT-S32.0.P$4(_:OUT) INPUT.0.P$18(-AXES:ABS-RZ-FLAT) INPUT.0.P$26(-AXES:ABS-X-FLAT) INPUT.0.P$34(-AXES:ABS-Y-FLAT) INPUT.0.P$42(-AXES:ABS-Z-FLAT)
N$18: CONSTANT.1.P$2 CONV-FLOAT-S32.0.P$3(_:IN)
N$42: INPUT.0.P$29(-AXES:ABS-X-IS-POS) OR2.7.P$2(_:IN0)
N$43: INPUT.0.P$28(-AXES:ABS-X-IS-NEG) OR2.7.P$3(_:IN1)
N$44: INPUT.0.P$37(-AXES:ABS-Y-IS-POS) OR2.8.P$2(_:IN0)
N$45: INPUT.0.P$36(-AXES:ABS-Y-IS-NEG) OR2.8.P$3(_:IN1)
N$46: INPUT.0.P$45(-AXES:ABS-Z-IS-POS) OR2.9.P$2(_:IN0)
N$47: INPUT.0.P$44(-AXES:ABS-Z-IS-NEG) OR2.9.P$3(_:IN1)
N$48: INPUT.0.P$21(-AXES:ABS-RZ-IS-POS) OR2.10.P$2(_:IN0)
N$49: INPUT.0.P$20(-AXES:ABS-RZ-IS-NEG) OR2.10.P$3(_:IN1)
X-BUTTONS-ACTIVE: OR2.4.P$4(_:OUT) OR2.5.P$2(_:IN0)
X-HAT-MINUS: INPUT.0.P$4(-AXES:ABS-HAT0X-IS-NEG) OR2.4.P$3(_:IN1) ; also sheet 15
X-HAT-PLUS: INPUT.0.P$5(-AXES:ABS-HAT0X-IS-POS) OR2.4.P$2(_:IN0) ; also sheet 15
X-JOG: INPUT.0.P$31(-AXES:ABS-X-POSITION) ; also sheet 15
X-KNOB-ACTIVE: NOT.0.P$1(_:IN) OR2.7.P$4(_:OUT) ; also sheet 14
X-KNOB-INACTIVE: NOT.0.P$2(_:OUT) ; also sheet 14
XY-BUTTONS-ACTIVE: OR2.5.P$4(_:OUT) ; also sheet 13,15
Y-BUTTONS-ACTIVE: OR2.5.P$3(_:IN1) OR2.6.P$4(_:OUT)
Y-HAT-MINUS: INPUT.0.P$16(-AXES:ABS-HAT0Y-IS-NEG) OR2.6.P$3(_:IN1) ; also sheet 15
Y-HAT-PLUS: INPUT.0.P$12(-AXES:ABS-HAT0Y-IS-POS) OR2.6.P$2(_:IN0) ; also sheet 15
Y-JOG: INPUT.0.P$39(-AXES:ABS-Y-POSITION) ; also sheet 15
Y-KNOB-ACTIVE: NOT.1.P$1(_:IN) OR2.8.P$4(_:OUT) ; also sheet 14
Y-KNOB-INACTIVE: NOT.1.P$2(_:OUT) ; also sheet 14
Z-JOG: INPUT.0.P$23(-AXES:ABS-RZ-POSITION) ; also sheet 15
Z-KNOB-ACTIVE: NOT.3.P$1(_:IN) OR2.10.P$4(_:OUT) ; also sheet 14
Z-KNOB-INACTIVE: NOT.3.P$2(_:OUT) ; also sheet 14
Unconnected: CONV-FLOAT-S32.0.P$2(.CLAMP:PIN_PARAMETER) CONV-FLOAT-S32.0.P$5(_:OUT-OF-RANGE) INPUT.0.P$1(-AXES:ABS-HAT0X-COUNTS) INPUT.0.P$2(-AXES:ABS-HAT0X-FLAT) INPUT.0.P$3(-AXES:ABS-HAT0X-FUZZ) INPUT.0.P$6(-AXES:ABS-HAT0X-OFFSET) INPUT.0.P$7(-AXES:ABS-HAT0X-POSITION) INPUT.0.P$8(-AXES:ABS-HAT0X-SCALE) INPUT.0.P$9(-AXES:ABS-HAT0Y-COUNTS) INPUT.0.P$10(-AXES:ABS-HAT0Y-FLAT) INPUT.0.P$11(-AXES:ABS-HAT0Y-FUZZ) INPUT.0.P$13(-AXES:ABS-HAT0Y-OFFSET) INPUT.0.P$14(-AXES:ABS-HAT0Y-POSITION) INPUT.0.P$15(-AXES:ABS-HAT0Y-SCALE) INPUT.0.P$17(-AXES:ABS-RZ-COUNTS) INPUT.0.P$19(-AXES:ABS-RZ-FUZZ) INPUT.0.P$22(-AXES:ABS-RZ-OFFSET) INPUT.0.P$24(-AXES:ABS-RZ-SCALE) INPUT.0.P$25(-AXES:ABS-X-COUNTS) INPUT.0.P$27(-AXES:ABS-X-FUZZ) INPUT.0.P$30(-AXES:ABS-X-OFFSET) INPUT.0.P$32(-AXES:ABS-X-SCALE) INPUT.0.P$33(-AXES:ABS-Y-COUNTS) INPUT.0.P$35(-AXES:ABS-Y-FUZZ) INPUT.0.P$38(-AXES:ABS-Y-OFFSET) INPUT.0.P$40(-AXES:ABS-Y-SCALE) INPUT.0.P$41(-AXES:ABS-Z-COUNTS) INPUT.0.P$43(-AXES:ABS-Z-FUZZ) INPUT.0.P$46(-AXES:ABS-Z-OFFSET) INPUT.0.P$48(-AXES:ABS-Z-SCALE)

### Notes on the sheet
- Hat values = -1.0, 0.0, +1.0
- Center deadband
- Z knob -> A axis
- RZ knob -> Z axis
- Joystick values = 0 .. 255

## Sheet 13 of 16
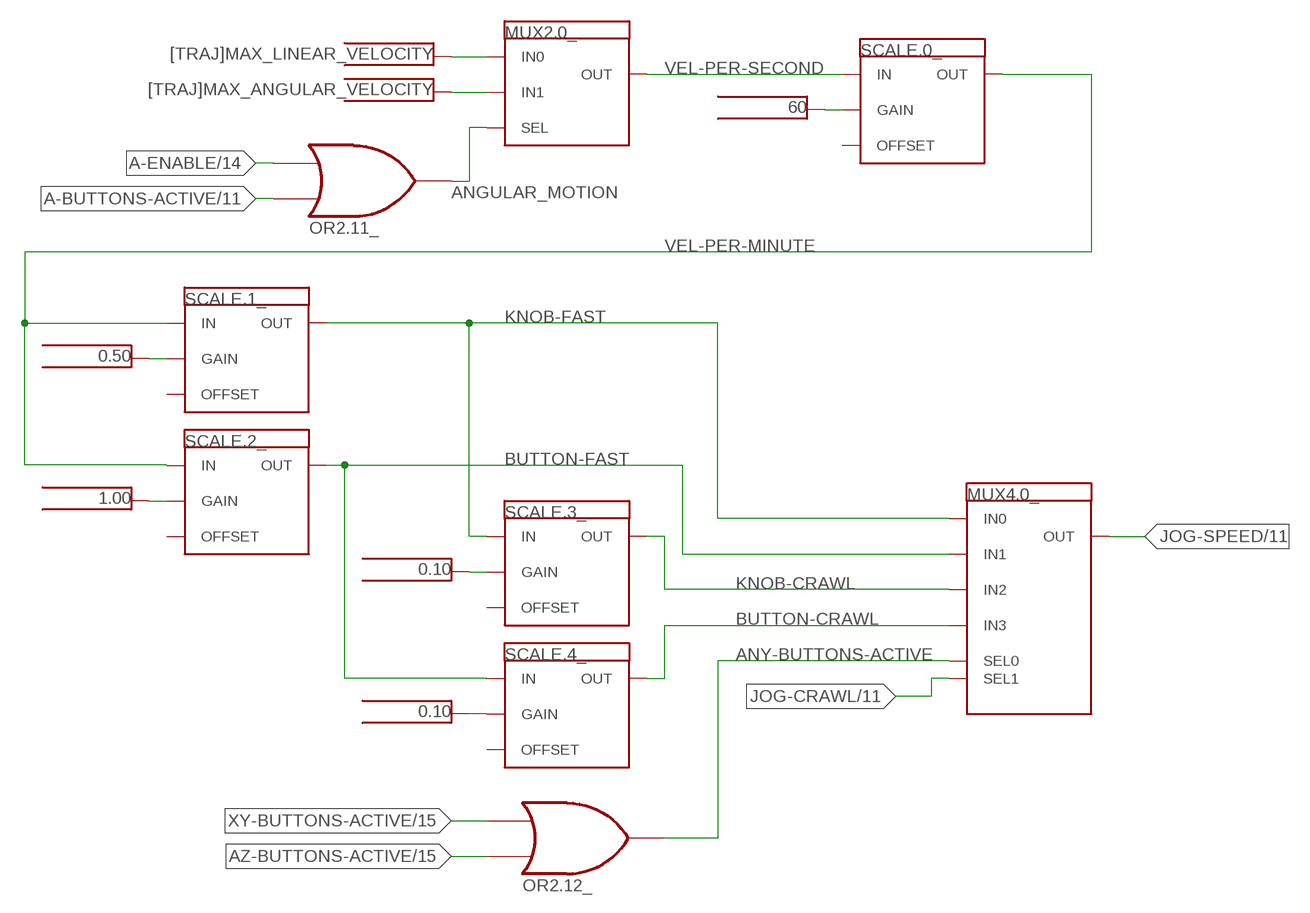
[diagram p12: schematic, sheet 13]

### Parts
CONSTANT.2  [TRAJ]MAX_LINEAR_VELOCITY  CONSTANT  [DUMMY]
CONSTANT.3  [TRAJ]MAX_ANGULAR_VELOCITY  CONSTANT  [DUMMY]
CONSTANT.4  60  CONSTANT  [DUMMY]
CONSTANT.5  0.50  CONSTANT  [DUMMY]
CONSTANT.6  1.00  CONSTANT  [DUMMY]
CONSTANT.7  0.10  CONSTANT  [DUMMY]
CONSTANT.8  0.10  CONSTANT  [DUMMY]
MUX2.0  MUX2  [DUMMY]
MUX4.0  MUX4  [DUMMY]
OR2.11  OR2  [DUMMY]
OR2.12  OR2  [DUMMY]
SCALE.0  SCALE  [DUMMY]
SCALE.1  SCALE  [DUMMY]
SCALE.2  SCALE  [DUMMY]
SCALE.3  SCALE  [DUMMY]
SCALE.4  SCALE  [DUMMY]

### Nets
A-BUTTONS-ACTIVE: OR2.11.P$3(_:IN1) ; also sheet 11
A-ENABLE: OR2.11.P$2(_:IN0) ; also sheet 14,15
ANGULAR_MOTION: MUX2.0.P$5(_:SEL) OR2.11.P$4(_:OUT)
ANY-BUTTONS-ACTIVE: MUX4.0.P$7(_:SEL0) OR2.12.P$4(_:OUT)
AZ-BUTTONS-ACTIVE: OR2.12.P$3(_:IN1) ; also sheet 11,15
BUTTON-CRAWL: MUX4.0.P$5(_:IN3) SCALE.4.P$5(_:OUT)
BUTTON-FAST: MUX4.0.P$3(_:IN1) SCALE.2.P$5(_:OUT) SCALE.4.P$3(_:IN)
JOG-CRAWL: MUX4.0.P$8(_:SEL1) ; also sheet 11
JOG-SPEED: MUX4.0.P$6(_:OUT) ; also sheet 11
KNOB-CRAWL: MUX4.0.P$4(_:IN2) SCALE.3.P$5(_:OUT)
KNOB-FAST: MUX4.0.P$2(_:IN0) SCALE.1.P$5(_:OUT) SCALE.3.P$3(_:IN)
N$19: CONSTANT.4.P$2 SCALE.0.P$2(_:GAIN)
N$20: CONSTANT.5.P$2 SCALE.1.P$2(_:GAIN)
N$21: CONSTANT.6.P$2 SCALE.2.P$2(_:GAIN)
N$22: CONSTANT.7.P$2 SCALE.3.P$2(_:GAIN)
N$23: CONSTANT.8.P$2 SCALE.4.P$2(_:GAIN)
N$25: CONSTANT.2.P$2 MUX2.0.P$2(_:IN0)
N$26: CONSTANT.3.P$2 MUX2.0.P$3(_:IN1)
VEL-PER-MINUTE: SCALE.0.P$5(_:OUT) SCALE.1.P$3(_:IN) SCALE.2.P$3(_:IN)
VEL-PER-SECOND: MUX2.0.P$4(_:OUT) SCALE.0.P$3(_:IN)
XY-BUTTONS-ACTIVE: OR2.12.P$2(_:IN0) ; also sheet 12,15
Unconnected: SCALE.0.P$4(_:OFFSET) SCALE.1.P$4(_:OFFSET) SCALE.2.P$4(_:OFFSET) SCALE.3.P$4(_:OFFSET) SCALE.4.P$4(_:OFFSET)

## Sheet 14 of 16
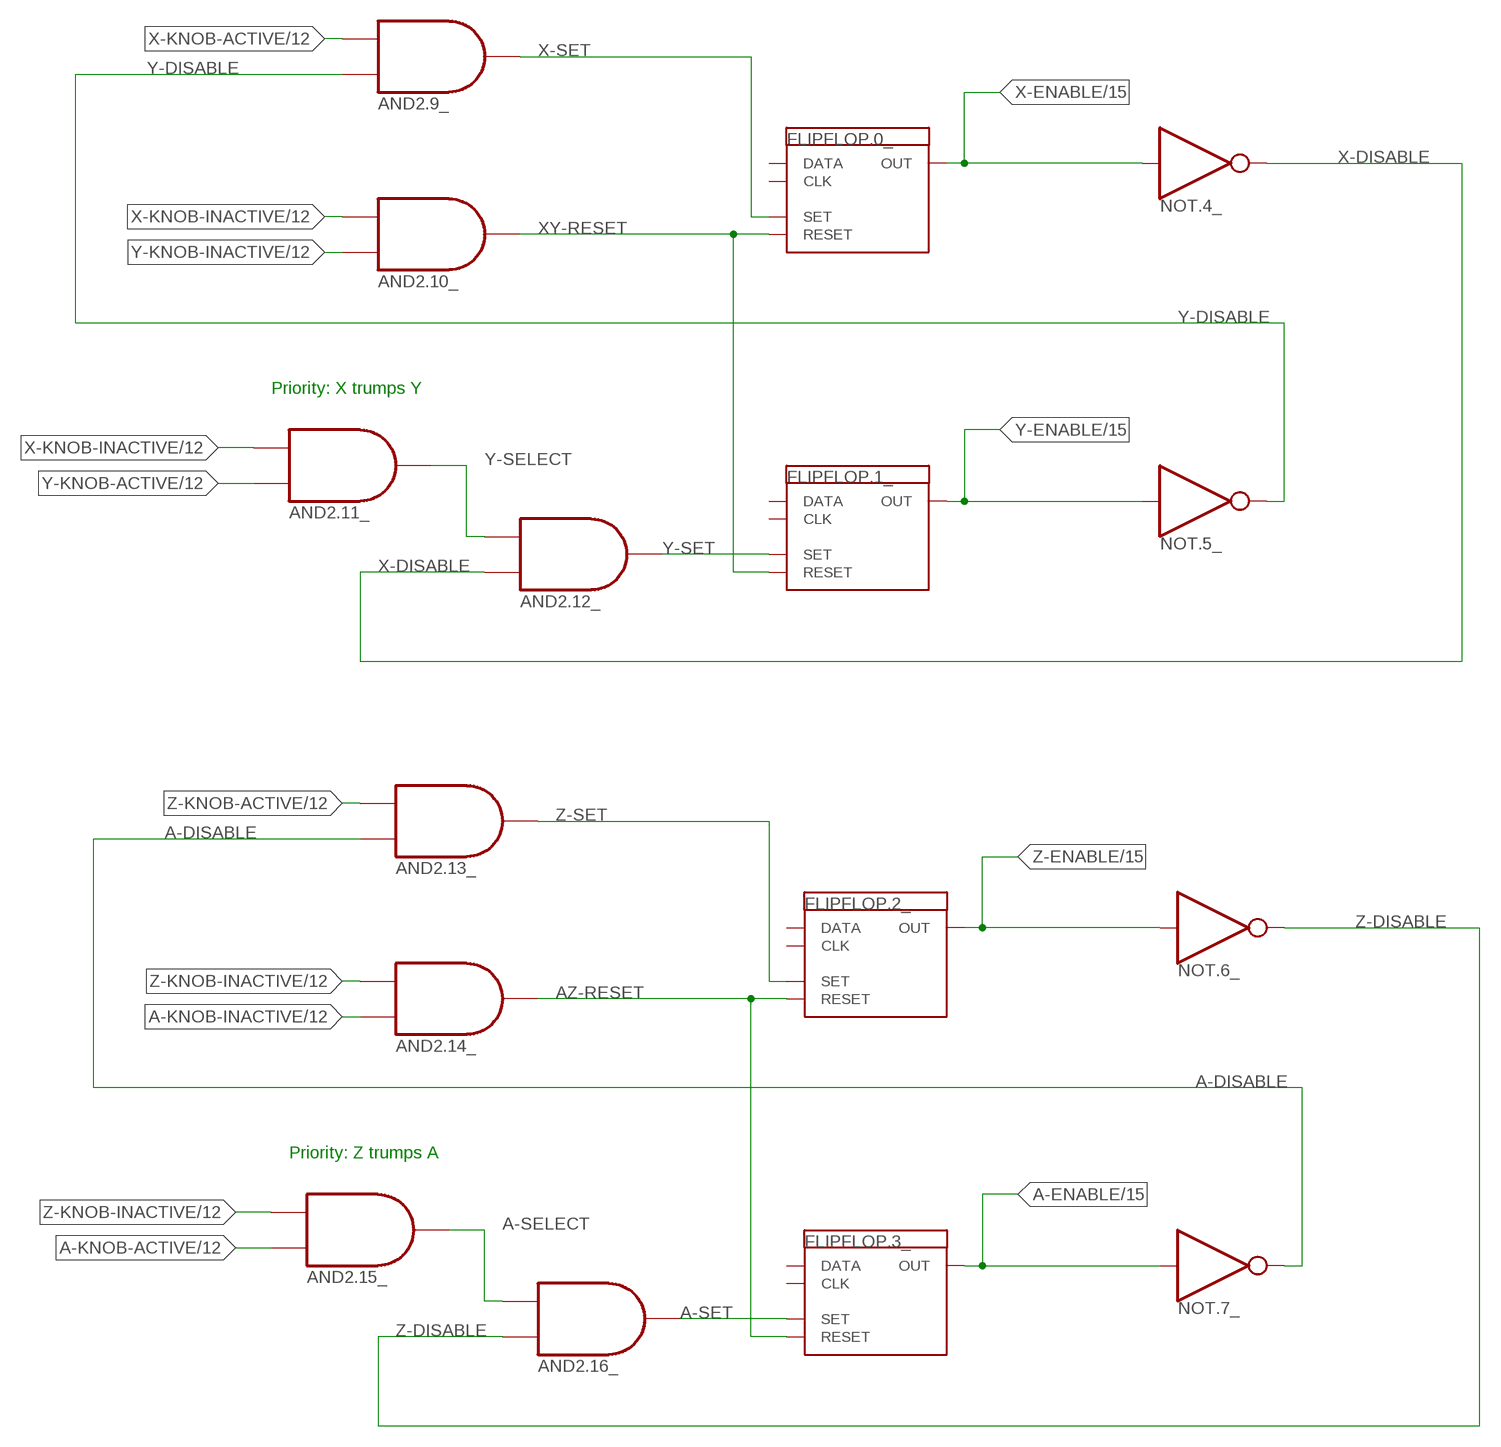
[diagram p13: schematic, sheet 14]

### Parts
AND2.9  AND2  [DUMMY]
AND2.10  AND2  [DUMMY]
AND2.11  AND2  [DUMMY]
AND2.12  AND2  [DUMMY]
AND2.13  AND2  [DUMMY]
AND2.14  AND2  [DUMMY]
AND2.15  AND2  [DUMMY]
AND2.16  AND2  [DUMMY]
FLIPFLOP.0  FLIPFLOP  [DUMMY]
FLIPFLOP.1  FLIPFLOP  [DUMMY]
FLIPFLOP.2  FLIPFLOP  [DUMMY]
FLIPFLOP.3  FLIPFLOP  [DUMMY]
NOT.4  NOT  [DUMMY]
NOT.5  NOT  [DUMMY]
NOT.6  NOT  [DUMMY]
NOT.7  NOT  [DUMMY]

### Nets
A-DISABLE: AND2.13.P$2(_:IN1) NOT.7.P$2(_:OUT)
A-ENABLE: FLIPFLOP.3.P$3(_:OUT) NOT.7.P$1(_:IN) ; also sheet 13,15
A-KNOB-ACTIVE: AND2.15.P$2(_:IN1) ; also sheet 12
A-KNOB-INACTIVE: AND2.14.P$2(_:IN1) ; also sheet 12
A-SELECT: AND2.15.P$3(_:OUT) AND2.16.P$1(_:IN0)
A-SET: AND2.16.P$3(_:OUT) FLIPFLOP.3.P$5(_:SET)
AZ-RESET: AND2.14.P$3(_:OUT) FLIPFLOP.2.P$4(_:RESET) FLIPFLOP.3.P$4(_:RESET)
X-DISABLE: AND2.12.P$2(_:IN1) NOT.4.P$2(_:OUT)
X-ENABLE: FLIPFLOP.0.P$3(_:OUT) NOT.4.P$1(_:IN) ; also sheet 15
X-KNOB-ACTIVE: AND2.9.P$1(_:IN0) ; also sheet 12
X-KNOB-INACTIVE: AND2.10.P$1(_:IN0) AND2.11.P$1(_:IN0) ; also sheet 12
X-SET: AND2.9.P$3(_:OUT) FLIPFLOP.0.P$5(_:SET)
XY-RESET: AND2.10.P$3(_:OUT) FLIPFLOP.0.P$4(_:RESET) FLIPFLOP.1.P$4(_:RESET)
Y-DISABLE: AND2.9.P$2(_:IN1) NOT.5.P$2(_:OUT)
Y-ENABLE: FLIPFLOP.1.P$3(_:OUT) NOT.5.P$1(_:IN) ; also sheet 15
Y-KNOB-ACTIVE: AND2.11.P$2(_:IN1) ; also sheet 12
Y-KNOB-INACTIVE: AND2.10.P$2(_:IN1) ; also sheet 12
Y-SELECT: AND2.11.P$3(_:OUT) AND2.12.P$1(_:IN0)
Y-SET: AND2.12.P$3(_:OUT) FLIPFLOP.1.P$5(_:SET)
Z-DISABLE: AND2.16.P$2(_:IN1) NOT.6.P$2(_:OUT)
Z-ENABLE: FLIPFLOP.2.P$3(_:OUT) NOT.6.P$1(_:IN) ; also sheet 15
Z-KNOB-ACTIVE: AND2.13.P$1(_:IN0) ; also sheet 12
Z-KNOB-INACTIVE: AND2.14.P$1(_:IN0) AND2.15.P$1(_:IN0) ; also sheet 12
Z-SET: AND2.13.P$3(_:OUT) FLIPFLOP.2.P$5(_:SET)
Unconnected: FLIPFLOP.0.P$1(_:CLK) FLIPFLOP.0.P$2(_:DATA) FLIPFLOP.1.P$1(_:CLK) FLIPFLOP.1.P$2(_:DATA) FLIPFLOP.2.P$1(_:CLK) FLIPFLOP.2.P$2(_:DATA) FLIPFLOP.3.P$1(_:CLK) FLIPFLOP.3.P$2(_:DATA)

### Notes on the sheet
- Priority: X trumps Y
- Priority: Z trumps A

## Sheet 15 of 16
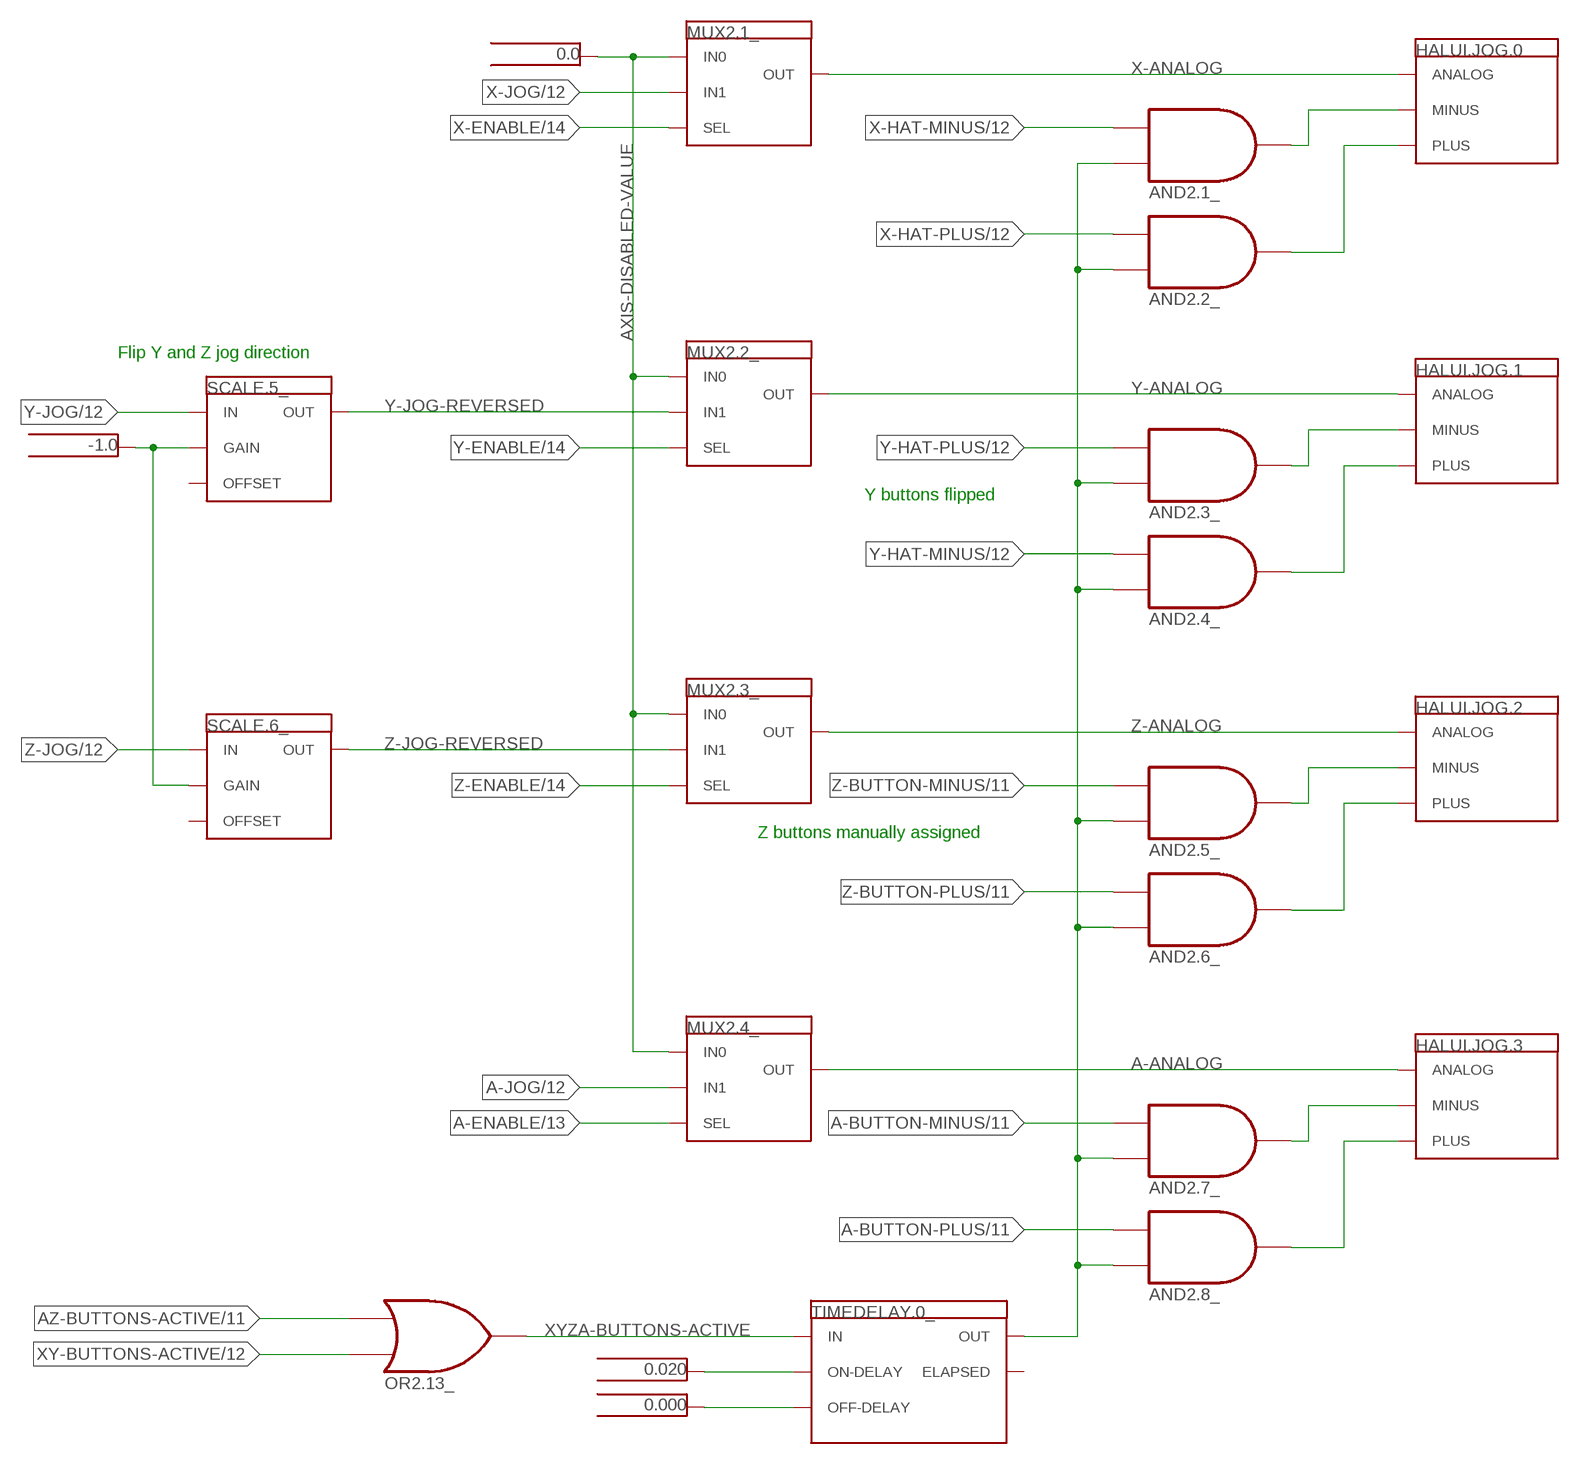
[diagram p14: schematic, sheet 15]

### Parts
AND2.1  AND2  [DUMMY]
AND2.2  AND2  [DUMMY]
AND2.3  AND2  [DUMMY]
AND2.4  AND2  [DUMMY]
AND2.5  AND2  [DUMMY]
AND2.6  AND2  [DUMMY]
AND2.7  AND2  [DUMMY]
AND2.8  AND2  [DUMMY]
CONSTANT.9  0.0  CONSTANT  [DUMMY]
CONSTANT.10  -1.0  CONSTANT  [DUMMY]
CONSTANT.11  0.020  CONSTANT  [DUMMY]
CONSTANT.12  0.000  CONSTANT  [DUMMY]
HALUI.JOG.0  HALUI.JOG  [DUMMY]
HALUI.JOG.1  HALUI.JOG  [DUMMY]
HALUI.JOG.2  HALUI.JOG  [DUMMY]
HALUI.JOG.3  HALUI.JOG  [DUMMY]
MUX2.1  MUX2  [DUMMY]
MUX2.2  MUX2  [DUMMY]
MUX2.3  MUX2  [DUMMY]
MUX2.4  MUX2  [DUMMY]
OR2.13  OR2  [DUMMY]
SCALE.5  SCALE  [DUMMY]
SCALE.6  SCALE  [DUMMY]
TIMEDELAY.0  TIMEDELAY  [DUMMY]

### Nets
A-ANALOG: HALUI.JOG.3.P$1(ANALOG) MUX2.4.P$4(_:OUT)
A-BUTTON-MINUS: AND2.7.P$1(_:IN0) ; also sheet 11
A-BUTTON-PLUS: AND2.8.P$1(_:IN0) ; also sheet 11
A-ENABLE: MUX2.4.P$5(_:SEL) ; also sheet 13,14
A-JOG: MUX2.4.P$3(_:IN1) ; also sheet 12
AXIS-DISABLED-VALUE: CONSTANT.9.P$2 MUX2.1.P$2(_:IN0) MUX2.2.P$2(_:IN0) MUX2.3.P$2(_:IN0) MUX2.4.P$2(_:IN0)
AZ-BUTTONS-ACTIVE: OR2.13.P$2(_:IN0) ; also sheet 11,13
N$51: CONSTANT.10.P$2 SCALE.5.P$2(_:GAIN) SCALE.6.P$2(_:GAIN)
N$54: CONSTANT.11.P$2 TIMEDELAY.0.P$4(ON-DELAY)
N$55: CONSTANT.12.P$2 TIMEDELAY.0.P$3(OFF-DELAY)
N$56: AND2.1.P$2(_:IN1) AND2.2.P$2(_:IN1) AND2.3.P$2(_:IN1) AND2.4.P$2(_:IN1) AND2.5.P$2(_:IN1) AND2.6.P$2(_:IN1) AND2.7.P$2(_:IN1) AND2.8.P$2(_:IN1) TIMEDELAY.0.P$5(OUT)
N$57: AND2.1.P$3(_:OUT) HALUI.JOG.0.P$2(MINUS)
N$58: AND2.2.P$3(_:OUT) HALUI.JOG.0.P$3(PLUS)
N$59: AND2.3.P$3(_:OUT) HALUI.JOG.1.P$2(MINUS)
N$60: AND2.4.P$3(_:OUT) HALUI.JOG.1.P$3(PLUS)
N$61: AND2.5.P$3(_:OUT) HALUI.JOG.2.P$2(MINUS)
N$62: AND2.6.P$3(_:OUT) HALUI.JOG.2.P$3(PLUS)
N$63: AND2.7.P$3(_:OUT) HALUI.JOG.3.P$2(MINUS)
N$64: AND2.8.P$3(_:OUT) HALUI.JOG.3.P$3(PLUS)
X-ANALOG: HALUI.JOG.0.P$1(ANALOG) MUX2.1.P$4(_:OUT)
X-ENABLE: MUX2.1.P$5(_:SEL) ; also sheet 14
X-HAT-MINUS: AND2.1.P$1(_:IN0) ; also sheet 12
X-HAT-PLUS: AND2.2.P$1(_:IN0) ; also sheet 12
X-JOG: MUX2.1.P$3(_:IN1) ; also sheet 12
XY-BUTTONS-ACTIVE: OR2.13.P$3(_:IN1) ; also sheet 12,13
XYZA-BUTTONS-ACTIVE: OR2.13.P$4(_:OUT) TIMEDELAY.0.P$2(IN)
Y-ANALOG: HALUI.JOG.1.P$1(ANALOG) MUX2.2.P$4(_:OUT)
Y-ENABLE: MUX2.2.P$5(_:SEL) ; also sheet 14
Y-HAT-MINUS: AND2.4.P$1(_:IN0) ; also sheet 12
Y-HAT-PLUS: AND2.3.P$1(_:IN0) ; also sheet 12
Y-JOG: SCALE.5.P$3(_:IN) ; also sheet 12
Y-JOG-REVERSED: MUX2.2.P$3(_:IN1) SCALE.5.P$5(_:OUT)
Z-ANALOG: HALUI.JOG.2.P$1(ANALOG) MUX2.3.P$4(_:OUT)
Z-BUTTON-MINUS: AND2.5.P$1(_:IN0) ; also sheet 11
Z-BUTTON-PLUS: AND2.6.P$1(_:IN0) ; also sheet 11
Z-ENABLE: MUX2.3.P$5(_:SEL) ; also sheet 14
Z-JOG: SCALE.6.P$3(_:IN) ; also sheet 12
Z-JOG-REVERSED: MUX2.3.P$3(_:IN1) SCALE.6.P$5(_:OUT)
Unconnected: SCALE.5.P$4(_:OFFSET) SCALE.6.P$4(_:OFFSET) TIMEDELAY.0.P$1(ELAPSED)

### Notes on the sheet
- Flip Y and Z jog direction
- Y buttons flipped
- Z buttons manually assigned

## Sheet 16 of 16
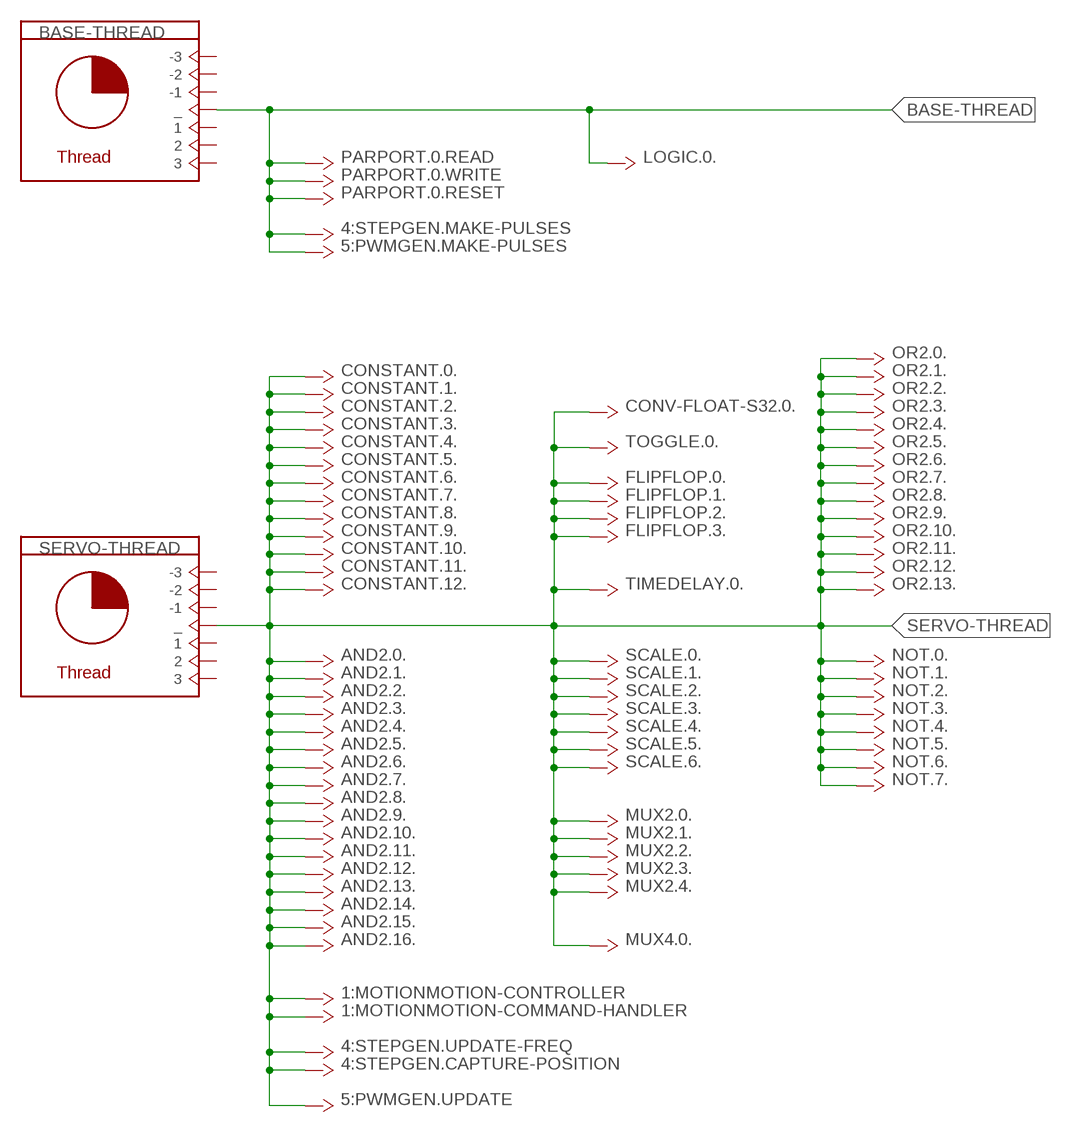
[diagram p15: schematic, sheet 16]

### Parts
BASE-THREAD  THREAD  [DUMMY]
SERVO-THREAD  THREAD  [DUMMY]

### Nets
BASE-THREAD: 4:STEPGEN.P$2(.MAKE-PULSES:PIN_THREAD) 5:PWMGEN.P$2(.MAKE-PULSES:PIN_THREAD) BASE-THREAD.P$7(_) LOGIC.0.P$1(.:PIN_THREAD) PARPORT.0.P$21(.READ:PIN_THREAD) PARPORT.0.P$23(.WRITE:PIN_THREAD) PARPORT.0.P$46(.RESET:PIN_THREAD)
SERVO-THREAD: 1:MOTION.P$1(MOTION-CONTROLLER:PIN_THREAD) 1:MOTION.P$2(MOTION-COMMAND-HANDLER:PIN_THREAD) 4:STEPGEN.P$1(.CAPTURE-POSITION:PIN_THREAD) 4:STEPGEN.P$3(.UPDATE-FREQ:PIN_THREAD) 5:PWMGEN.P$1(.UPDATE:PIN_THREAD) AND2.0.P$4(.:PIN_THREAD) AND2.1.P$4(.:PIN_THREAD) AND2.2.P$4(.:PIN_THREAD) AND2.3.P$4(.:PIN_THREAD) AND2.4.P$4(.:PIN_THREAD) AND2.5.P$4(.:PIN_THREAD) AND2.6.P$4(.:PIN_THREAD) AND2.7.P$4(.:PIN_THREAD) AND2.8.P$4(.:PIN_THREAD) AND2.9.P$4(.:PIN_THREAD) AND2.10.P$4(.:PIN_THREAD) AND2.11.P$4(.:PIN_THREAD) AND2.12.P$4(.:PIN_THREAD) AND2.13.P$4(.:PIN_THREAD) AND2.14.P$4(.:PIN_THREAD) AND2.15.P$4(.:PIN_THREAD) AND2.16.P$4(.:PIN_THREAD) CONSTANT.0.P$1 CONSTANT.1.P$1 CONSTANT.2.P$1 CONSTANT.3.P$1 CONSTANT.4.P$1 CONSTANT.5.P$1 CONSTANT.6.P$1 CONSTANT.7.P$1 CONSTANT.8.P$1 CONSTANT.9.P$1 CONSTANT.10.P$1 CONSTANT.11.P$1 CONSTANT.12.P$1 CONV-FLOAT-S32.0.P$1(.:PIN_THREAD) FLIPFLOP.0.P$6(.:PIN_THREAD) FLIPFLOP.1.P$6(.:PIN_THREAD) FLIPFLOP.2.P$6(.:PIN_THREAD) FLIPFLOP.3.P$6(.:PIN_THREAD) MUX2.0.P$1(.:PIN_THREAD) MUX2.1.P$1(.:PIN_THREAD) MUX2.2.P$1(.:PIN_THREAD) MUX2.3.P$1(.:PIN_THREAD) MUX2.4.P$1(.:PIN_THREAD) MUX4.0.P$1(.:PIN_THREAD) NOT.0.P$3(.:PIN_THREAD) NOT.1.P$3(.:PIN_THREAD) NOT.2.P$3(.:PIN_THREAD) NOT.3.P$3(.:PIN_THREAD) NOT.4.P$3(.:PIN_THREAD) NOT.5.P$3(.:PIN_THREAD) NOT.6.P$3(.:PIN_THREAD) NOT.7.P$3(.:PIN_THREAD) OR2.0.P$1(.:PIN_THREAD) OR2.1.P$1(.:PIN_THREAD) OR2.2.P$1(.:PIN_THREAD) OR2.3.P$1(.:PIN_THREAD) OR2.4.P$1(.:PIN_THREAD) OR2.5.P$1(.:PIN_THREAD) OR2.6.P$1(.:PIN_THREAD) OR2.7.P$1(.:PIN_THREAD) OR2.8.P$1(.:PIN_THREAD) OR2.9.P$1(.:PIN_THREAD) OR2.10.P$1(.:PIN_THREAD) OR2.11.P$1(.:PIN_THREAD) OR2.12.P$1(.:PIN_THREAD) OR2.13.P$1(.:PIN_THREAD) SCALE.0.P$1(.:PIN_THREAD) SCALE.1.P$1(.:PIN_THREAD) SCALE.2.P$1(.:PIN_THREAD) SCALE.3.P$1(.:PIN_THREAD) SCALE.4.P$1(.:PIN_THREAD) SCALE.5.P$1(.:PIN_THREAD) SCALE.6.P$1(.:PIN_THREAD) SERVO-THREAD.P$7(_) TIMEDELAY.0.P$6(PIN_THREAD) TOGGLE.0.P$1(.:PIN_THREAD)
Unconnected: BASE-THREAD.P$1(-1) BASE-THREAD.P$2(-2) BASE-THREAD.P$3(-3) BASE-THREAD.P$4 BASE-THREAD.P$5 BASE-THREAD.P$6 SERVO-THREAD.P$1(-1) SERVO-THREAD.P$2(-2) SERVO-THREAD.P$3(-3) SERVO-THREAD.P$4 SERVO-THREAD.P$5 SERVO-THREAD.P$6

## Library data of the parts
0:MODULE1 2:MODULE2 8:MODULE8 = hal-config:LOADRT: HAL LoadRT Loads realtime module Part Name field = <index>:MODULEn Set <index> to control load sequence MODULEn triggers Eagle-to-HAL script Part Value field = HAL module command line: loadrt threads name1=test-thread period1=1000000
1:MOTION = hal-config:LOADRT_MOTMOD
3:HAL_PARPORT = hal-config:LOADRT_PARPORT
4:STEPGEN = hal-config:LOADRT_STEPGEN
5:PWMGEN = hal-config:LOADRT_PWMGEN
AND2.0 AND2.1-AND2.16 = hal-config:AND2: HAL AND2 Boolean 2-input AND
AXIS.0 AXIS.1-AXIS.3 = hal-config:AXIS: Axis-Module of MOTMOD Installing loadrt motmod [base_period_nsec=period] [servo_period_nsec=period] [traj_period_nsec=period] [key=SHMEM_KEY] [num_joints=[0-9]] Parameters axis.N.active TRUE when this joint is active axis.N.backlash-corr Backlash or screw compensation raw value axis.N.backlash-filt Backlash or screw compensation filtered value (respecting motion limits) axis.N.backlash-vel Backlash or screw compensation velocity axis.N.coarse-pos-cmd axis.N.error TRUE when this joint has encountered an error, such as a limit switch closing axis.N.f-error The actual following error axis.N.f-error-lim The following error limit axis.N.f-errored TRUE when this joint has exceeded the following error limit axis.N.faulted axis.N.free-pos-cmd The "free planner" commanded position for this joint. axis.N.free-tp-enable TRUE when the "free planner" is enabled for this joint axis.N.free-vel-lim The velocity limit for the free planner axis.N.home-state Reflects the step of homing currently taking place axis.N.homed TRUE if the joint has been homed axis.N.in-position TRUE if the joint is using the "free planner" and has come to a stop axis.N.joint-vel-cmd The joint?s commanded velocity axis.N.kb-jog-active axis.N.neg-hard-limit The negative hard limit for the joint (removed) axis.N.neg-soft-limit The negative soft limit for the joint axis.N.pos-hard-limit The positive hard limit for the joint (removed) axis.N.pos-soft-limit The positive soft limit for the joint axis.N.wheel-jog-active
BASE-THREAD SERVO-THREAD = hal-config:THREAD
CONSTANT.0 CONSTANT.1-CONSTANT.12 = hal-config:CONSTANT: Emit constant value Rename first device: constant.1 -> constant.0
CONV-FLOAT-S32.0 = hal-config:CONV_FLOAT_S32: CONV_FLOAT_S32 NAME conv_float_s32 − Convert a value from float to s32 SYNOPSIS loadrt conv_float_s32 [count=N|names=name1[,name2...]] FUNCTIONS conv-float-s32.N (requires a floating-point thread) Update ’out’ based on ’in’ PINS conv-float-s32.N.in float in conv-float-s32.N.out s32 out conv-float-s32.N.out-of-range bit out TRUE when ’in’ is not in the range of s32 PARAMETERS conv-float-s32.N.clamp bit rw If TRUE, then clamp to the range of s32. If FALSE, then allow the value to "wrap around". LICENSE GPL
FLIPFLOP.0 FLIPFLOP.1-FLIPFLOP.3 = hal-config:FLIPFLOP: FLIPFLOP NAME flipflop − D type flip-flop SYNOPSIS loadrt flipflop [count=N|names=name1[,name2...]] FUNCTIONS flipflop.N PINS flipflop.N.data bit in data input flipflop.N.clk bit in clock, rising edge writes data to out flipflop.N.set bit in when true, force out true flipflop.N.reset bit in when true, force out false; overrides set flipflop.N.out bit io output LICENSE GPL
HAL_MANUALTOOLCHANGE = hal-config:HAL_MANUALTOOLCHANGE: Manual Tool Change Interface the manual toolchange UI with HAL pins
HALUI = hal-config:HALUI: HalUI Interface to HAL Because there can be only one HALUI, you must delete the device number after placement: HALUI.1 -> HALUI Invoke the HALUI device to add other blocks. Axis, jogs, and joints are in separate devices to allow automagic device numbering.
HALUI.JOG.0 HALUI.JOG.1-HALUI.JOG.3 = hal-config:HALUI.JOG: Device for jogging individual joint Add one halui.jog device for each joint Rename first device after placing: halui.jog.1 -> halui.jog.0 Add halui.jogsel device to get common jog pins
INPUT.0 = hal-config:LOGITECH-DUAL-ACTION-GAMEPAD: Logitech Dual Action Gamepad Add one device for each gamepad Rename input.1 -> input.0
IOCONTROL.0 = hal-config:IOCONTROL: IOCONTROL NAME iocontrol − accepts NML I/O commands, interacts with HAL in userspace SYNOPSIS loadusr io [-ini inifile] DESCRIPTION These pins are created by the userspace IO controller, usually found in $LINUXCNC_HOME/bin/io The signals are turned on and off in userspace - if you have strict timing requirements or simply need more i/o, consider using the realtime synchronized i/o provided by motion(9) instead. The inifile is searched for in the directory from which halcmd was run, unless an absolute path is specified. PINS iocontrol.0.coolant-flood (Bit, Out) TRUE when flood coolant is requested iocontrol.0.coolant-mist (Bit, Out) TRUE when mist coolant is requested iocontrol.0.emc-enable-in (Bit, In) Should be driven FALSE when an external estop condition exists. iocontrol.0.lube (Bit, Out) TRUE when lube is requested iocontrol.0.lube_level (Bit, In) Should be driven FALSE when lubrication tank is empty. iocontrol.0.tool-change (Bit, Out) TRUE when a tool change is requested iocontrol.0.tool-changed (Bit, In) Should be driven TRUE when a tool change is completed. iocontrol.0.tool-number (s32, Out) Current tool number iocontrol.0.tool-prep-number (s32, Out) The number of the next tool, from the RS274NGC T-word iocontrol.0.tool-prep-pocket (s32, Out) The pocket number (location in tool storage mechanism) of the next tool, as described in the tool table iocontrol.0.tool-prepare (Bit, Out) TRUE when a Tn tool prepare is requested iocontrol.0.tool-prepared (Bit, In) Should be driven TRUE when a tool prepare is completed. iocontrol.0.user-enable-out (Bit, Out) FALSE when an internal estop condition exists iocontrol.0.user-request-enable (Bit, Out) TRUE when the user has requested that estop be cleared SEE ALSO motion(9)
LOGIC.0 = hal-config:LOGIC: LOGIC NAME logic − LinuxCNC HAL component providing configurable logic functions SYNOPSIS loadrt logic [count=N|names=name1[,name2...]] [personality=P,P,...] DESCRIPTION General ’logic function’ component. Can perform ’and’, ’or’ and ’xor’ of up to 16 inputs. Determine the proper value for ’personality’ by adding the inputs and outputs then convert to hex: • The number of input pins, usually from 2 to 16 • 256 (0x100) if the ’and’ output is desired • 512 (0x200) if the ’or’ output is desired • 1024 (0x400) if the ’xor’ (exclusive or) output is desired Outputs can be combined, for example 2 + 256 + 1024 = 1282 converted to hex would be 0x502 and would have two inputs and have both ’xor’ and ’and’ outputs. FUNCTIONS logic.N PINS logic.N.in-MM bit in (MM=00..personality & 0xff) logic.N.and bit out [if personality & 0x100] logic.N.or bit out [if personality & 0x200] logic.N.xor bit out [if personality & 0x400]
MOTION = hal-config:MOTION: Motion-Module of MOTMOD Installing loadrt motmod [base_period_nsec=period] [servo_period_nsec=period] [traj_period_nsec=period] [key=SHMEM_KEY] [num_joints=[0-9]] Parameters motion-command-handler.time motion-command-handler.tmax motion-controller.time motion-controller.tmax motion.coord-error TRUE when motion has encountered an error, such as exceeding a soft limit motion.coord-mode TRUE when motion is in "coordinated mode", as opposed to "teleop mode" motion.current-vel motion.debug-* These values are used for debugging purposes. motion.in-position Same as the pin motion.motion-inpos motion.motion-enabled TRUE when motion is enabled motion.on-soft-limit motion.program-line motion.servo.last-period The number of CPU cycles between invocations of the servo thread. Typically, this number divided by the CPU speed gives the time in seconds, and can be used to determine whether the realtime motion controller is meeting its timing constraints motion.servo.overruns By noting large differences between successive values of motion.servo.last-period, the motion controller can determine that there has probably been a failure to meet its timing constraints. Each time such a failure is detected, this value is incremented. motion.teleop-mode TRUE when motion is in "teleop mode", as opposed to "coordinated mode"
MUX2.0 MUX2.1-MUX2.4 = hal-config:MUX2: Select 1 of 2 inputs Rename first device: mux2.1 -> mux2.0
MUX4.0 = hal-config:MUX4: Select 1 of 4 inputs Rename first device: mux4.1 -> mux4.0
NOT.0 NOT.1-NOT.7 = hal-config:NOT: HAL NOT
OR2.0 OR2.1-OR2.13 = hal-config:OR2: HAL OR2
PARAMETER0 PARAMETER1-PARAMETER30 = hal-config:PARAMETER
PARPORT.0 = hal-config:PARPORT-OUT: Parallel Port as Output The main data bits (pins 2..9) are used as outputs. Use Value for setting the address of the parallel port. Installing loadrt hal_parport cfg="<config-string>" loadrt hal_parport cfg="0x278 0x378 in 0x20A0 out" Parameters ( B I T ) parport.[portnum].pin-[pinnum]-out-invert Inverts an output pin. ( B I T ) parport.[portnum].pin-[pinnum]-out-reset (only for pins 2..9) ? TRUE if this pin should be reset when the -reset function is executed. (U32) parport.[portnum].reset-time The time (in nanoseconds) between a pin is set by write and reset by reset HAL functions.
SCALE.0 SCALE.1-SCALE.6 = hal-config:SCALE: Scale and offset input value Rename first device: scale.1 -> scale.0
STEPGEN.0 STEPGEN.1-STEPGEN.3 = hal-config:STEPGEN-0: STEPGEN - Mode 0 = Step/Dir NAME stepgen − software step pulse generation SYNOPSIS loadrt stepgen step_type=type0[,type1...] [ctrl_type=type0[,type1...]] [user_step_type=#,#...] DESCRIPTION stepgen is used to control stepper motors. The maximum step rate depends on the CPU and other factors, and is usually in the range of 5KHz to 25KHz. If higher rates are needed, a hardware step generator is a better choice. stepgen has two control modes, which can be selected on a channel by channel basis using ctrl_type. Possible values are "p" for position control, and "v" for velocity control. The default is position control, which drives the motor to a commanded position, subject to acceleration and velocity limits. Velocity control drives the motor at a commanded speed, again subject to accel and velocity limits. Usually, position mode is used for machine axes. Velocity mode is reserved for unusual applications where continuous movement at some speed is desired, instead of movement to a specific position. (Note that velocity mode replaces the former component freqgen.) stepgen can control a maximum of eight motors. The number of motors/channels actually loaded depends on the number of type values given. The value of each type determines the outputs for that channel. Position or velocity mode can be individually selected for each channel. Both control modes support the same 16 possible step types. By far the most common step type is ’0’, standard step and direction. Others include up/down, quadrature, and a wide variety of three, four, and five phase patterns that can be used to directly control some types of motor windings. (When used with appropriate buffers of course.) Some of the stepping types are described below, but for more details (including timing diagrams) see the stepgen section of the HAL reference manual. type 0: step/dir Two pins, one for step and one for direction. make-pulses must run at least twice for each step (once to set the step pin true, once to clear it). This limits the maximum step rate to half (or less) of the rate that can be reached by types 2-14. The parameters steplen and stepspace can further lower the maximum step rate. Parameters dirsetup and dirhold also apply to this step type. type 1: up/down Two pins, one for ’step up’ and one for ’step down’. Like type 0, make-pulses must run twice per step, which limits the maximum speed. type 2: quadrature Two pins, phase-A and phase-B. For forward motion, A leads B. Can advance by one step every time make-pulses runs. type 3: three phase, full step Three pins, phase-A, phase-B, and phase-C. Three steps per full cycle, then repeats. Only one phase is high at a time - for forward motion the pattern is A, then B, then C, then A again. type 4: three phase, half step Three pins, phases A through C. Six steps per full cycle. First A is high alone, then A and B together, then B alone, then B and C together, etc. types 5 through 8: four phase, full step Four pins, phases A through D. Four steps per full cycle. Types 5 and 6 are suitable for use with unipolar steppers, where power is applied to the center tap of each winding, and four open-collector transistors drive the ends. Types 7 and 8 are suitable for bipolar steppers, driven by two H-bridges. types 9 and 10: four phase, half step Four pins, phases A through D. Eight steps per full cycle. Type 9 is suitable for unipolar drive, and type 10 for bipolar drive. types 11 and 12: five phase, full step Five pins, phases A through E. Five steps per full cycle. See HAL reference manual for the patterns. types 13 and 14: five phase, half step Five pins, phases A through E. Ten steps per full cycle. See HAL reference manual for the patterns. type 15: user-specified This uses the waveform specified by the user_step_type module parameter, which may have up to 10 steps and 5 phases. FUNCTIONS stepgen.make-pulses (no floating-point) Generates the step pulses, using information computed by update-freq. Must be called as frequently as possible, to maximize the attainable step rate and minimize jitter. Operates on all channels at once. stepgen.capture-position (uses floating point) Captures position feedback value from the high speed code and makes it available on a pin for use elsewhere in the system. Operates on all channels at once. stepgen.update-freq (uses floating point) Accepts a velocity or position command and converts it into a form usable by make-pulses for step generation. Operates on all channels at once. PINS stepgen.N.counts s32 out The current position, in counts, for channel N. Updated by capture-position. stepgen.N.position-fb float out The current position, in length units (see parameter position-scale). Updated by capture-position. The resolution of position-fb is much finer than a single step. If you need to see individual steps, use counts. stepgen.N.enable bit in Enables output steps - when false, no steps are generated. stepgen.N.velocity-cmd float in (velocity mode only) Commanded velocity, in length units per second (see parameter position-scale). stepgen.N.position-cmd float in (position mode only) Commanded position, in length units (see parameter position-scale). stepgen.N.step bit out (step type 0 only) Step pulse output. stepgen.N.dir bit out (step type 0 only) Direction output: low for forward, high for reverse. stepgen.N.up bit out (step type 1 only) Count up output, pulses for forward steps. stepgen.N.down bit out (step type 1 only) Count down output, pulses for reverse steps. stepgen.N.phase-A thru phase-E bit out (step types 2-14 only) Output bits. phase-A and phase-B are present for step types 2-14, phase-C for types 3-14, phase-D for types 5-14, and phase-E for types 11-14. Behavior depends on selected stepping type. PARAMETERS stepgen.N.frequency float ro The current step rate, in steps per second, for channel N. stepgen.N.maxaccel float rw The acceleration/deceleration limit, in length units per second squared. stepgen.N.maxvel float rw The maximum allowable velocity, in length units per second. If the requested maximum velocity cannot be reached with the current combination of scaling and make-pulses thread period, it will be reset to the highest attainable value. stepgen.N.position-scale float rw The scaling for position feedback, position command, and velocity command, in steps per length unit. stepgen.N.rawcounts s32 ro The position in counts, as updated by make-pulses. (Note: this is updated more frequently than the counts pin.) stepgen.N.steplen u32 rw The length of the step pulses, in nanoseconds. Measured from rising edge to falling edge. stepgen.N.stepspace u32 rw (step types 0 and 1 only) The minimum space between step pulses, in nanoseconds. Measured from falling edge to rising edge. The actual time depends on the step rate and can be much longer. If stepspace is 0, then step can be asserted every period. This can be used in conjunction with hal_parport’s auto-resetting pins to output one step pulse per period. In this mode, steplen must be set for one period or less. stepgen.N.dirsetup u32 rw (step type 0 only) The minimum setup time from direction to step, in nanoseconds periods. Measured from change of direction to rising edge of step. stepgen.N.dirhold u32 rw (step type 0 only) The minimum hold time of direction after step, in nanoseconds. Measured from falling edge of step to change of direction. stepgen.N.dirdelay u32 rw (step types 1 and higher only) The minimum time between a forward step and a reverse step, in nanoseconds. TIMING There are five timing parameters which control the output waveform. No step type uses all five, and only those which will be used are exported to HAL. The values of these parameters are in nano-seconds, so no recalculation is needed when changing thread periods. In the timing diagrams that follow, they are identfied by the following numbers: (1) stepgen.n.steplen (2) stepgen.n.stepspace (3) stepgen.n.dirhold (4) stepgen.n.dirsetup (5) stepgen.n.dirdelay For step type 0, timing parameters 1 thru 4 are used. The following timing diagram shows the output waveforms, and what each parameter adjusts. _____ _____ _____ STEP ____/ \_______/ \_____________/ \______ | | | | | | Time |-(1)-|--(2)--|-(1)-|--(3)--|-(4)-|-(1)-| |__________________ DIR ________________________________/ For step type 1, timing parameters 1, 2, and 5 are used. The following timing diagram shows the output waveforms, and what each parameter adjusts. _____ _____ UP __/ \_____/ \________________________________ | | | | | Time |-(1)-|-(2)-|-(1)-|---(5)---|-(1)-|-(2)-|-(1)-| |_____| |_____| DOWN ______________________________/ \_____/ \____ For step types 2 and higher, the exact pattern of the outputs depends on the step type (see the HAL manual for a full listing). The outputs change from one state to another at a minimum interval of steplen. When a direction change occurs, the minimum time between the last step in one direction and the first in the other direction is the sum of steplen and dirdelay.
TIMEDELAY.0 = hal-config:TIMEDELAY: Delays IN to OUT by specified number of seconds Rename first device timedelay.1 -> timedelay.0
TOGGLE.0 = hal-config:TOGGLE: On / Off from momentary input Rename first device: toggle.1 -> toggle.0